# EasyEDA Pro project 赛季装甲板.eprj

# Schematic 装甲板

## Sheets
1 电源: Board Name: Board1; Create Date: 2025-10-13; Page Name: 电源; Project Name: 赛季装甲板; Schematic Name: 装甲板; Update Date: 2025-11-15; Company: 嘉立创EDA; Page Size: A4; Version: V1.0
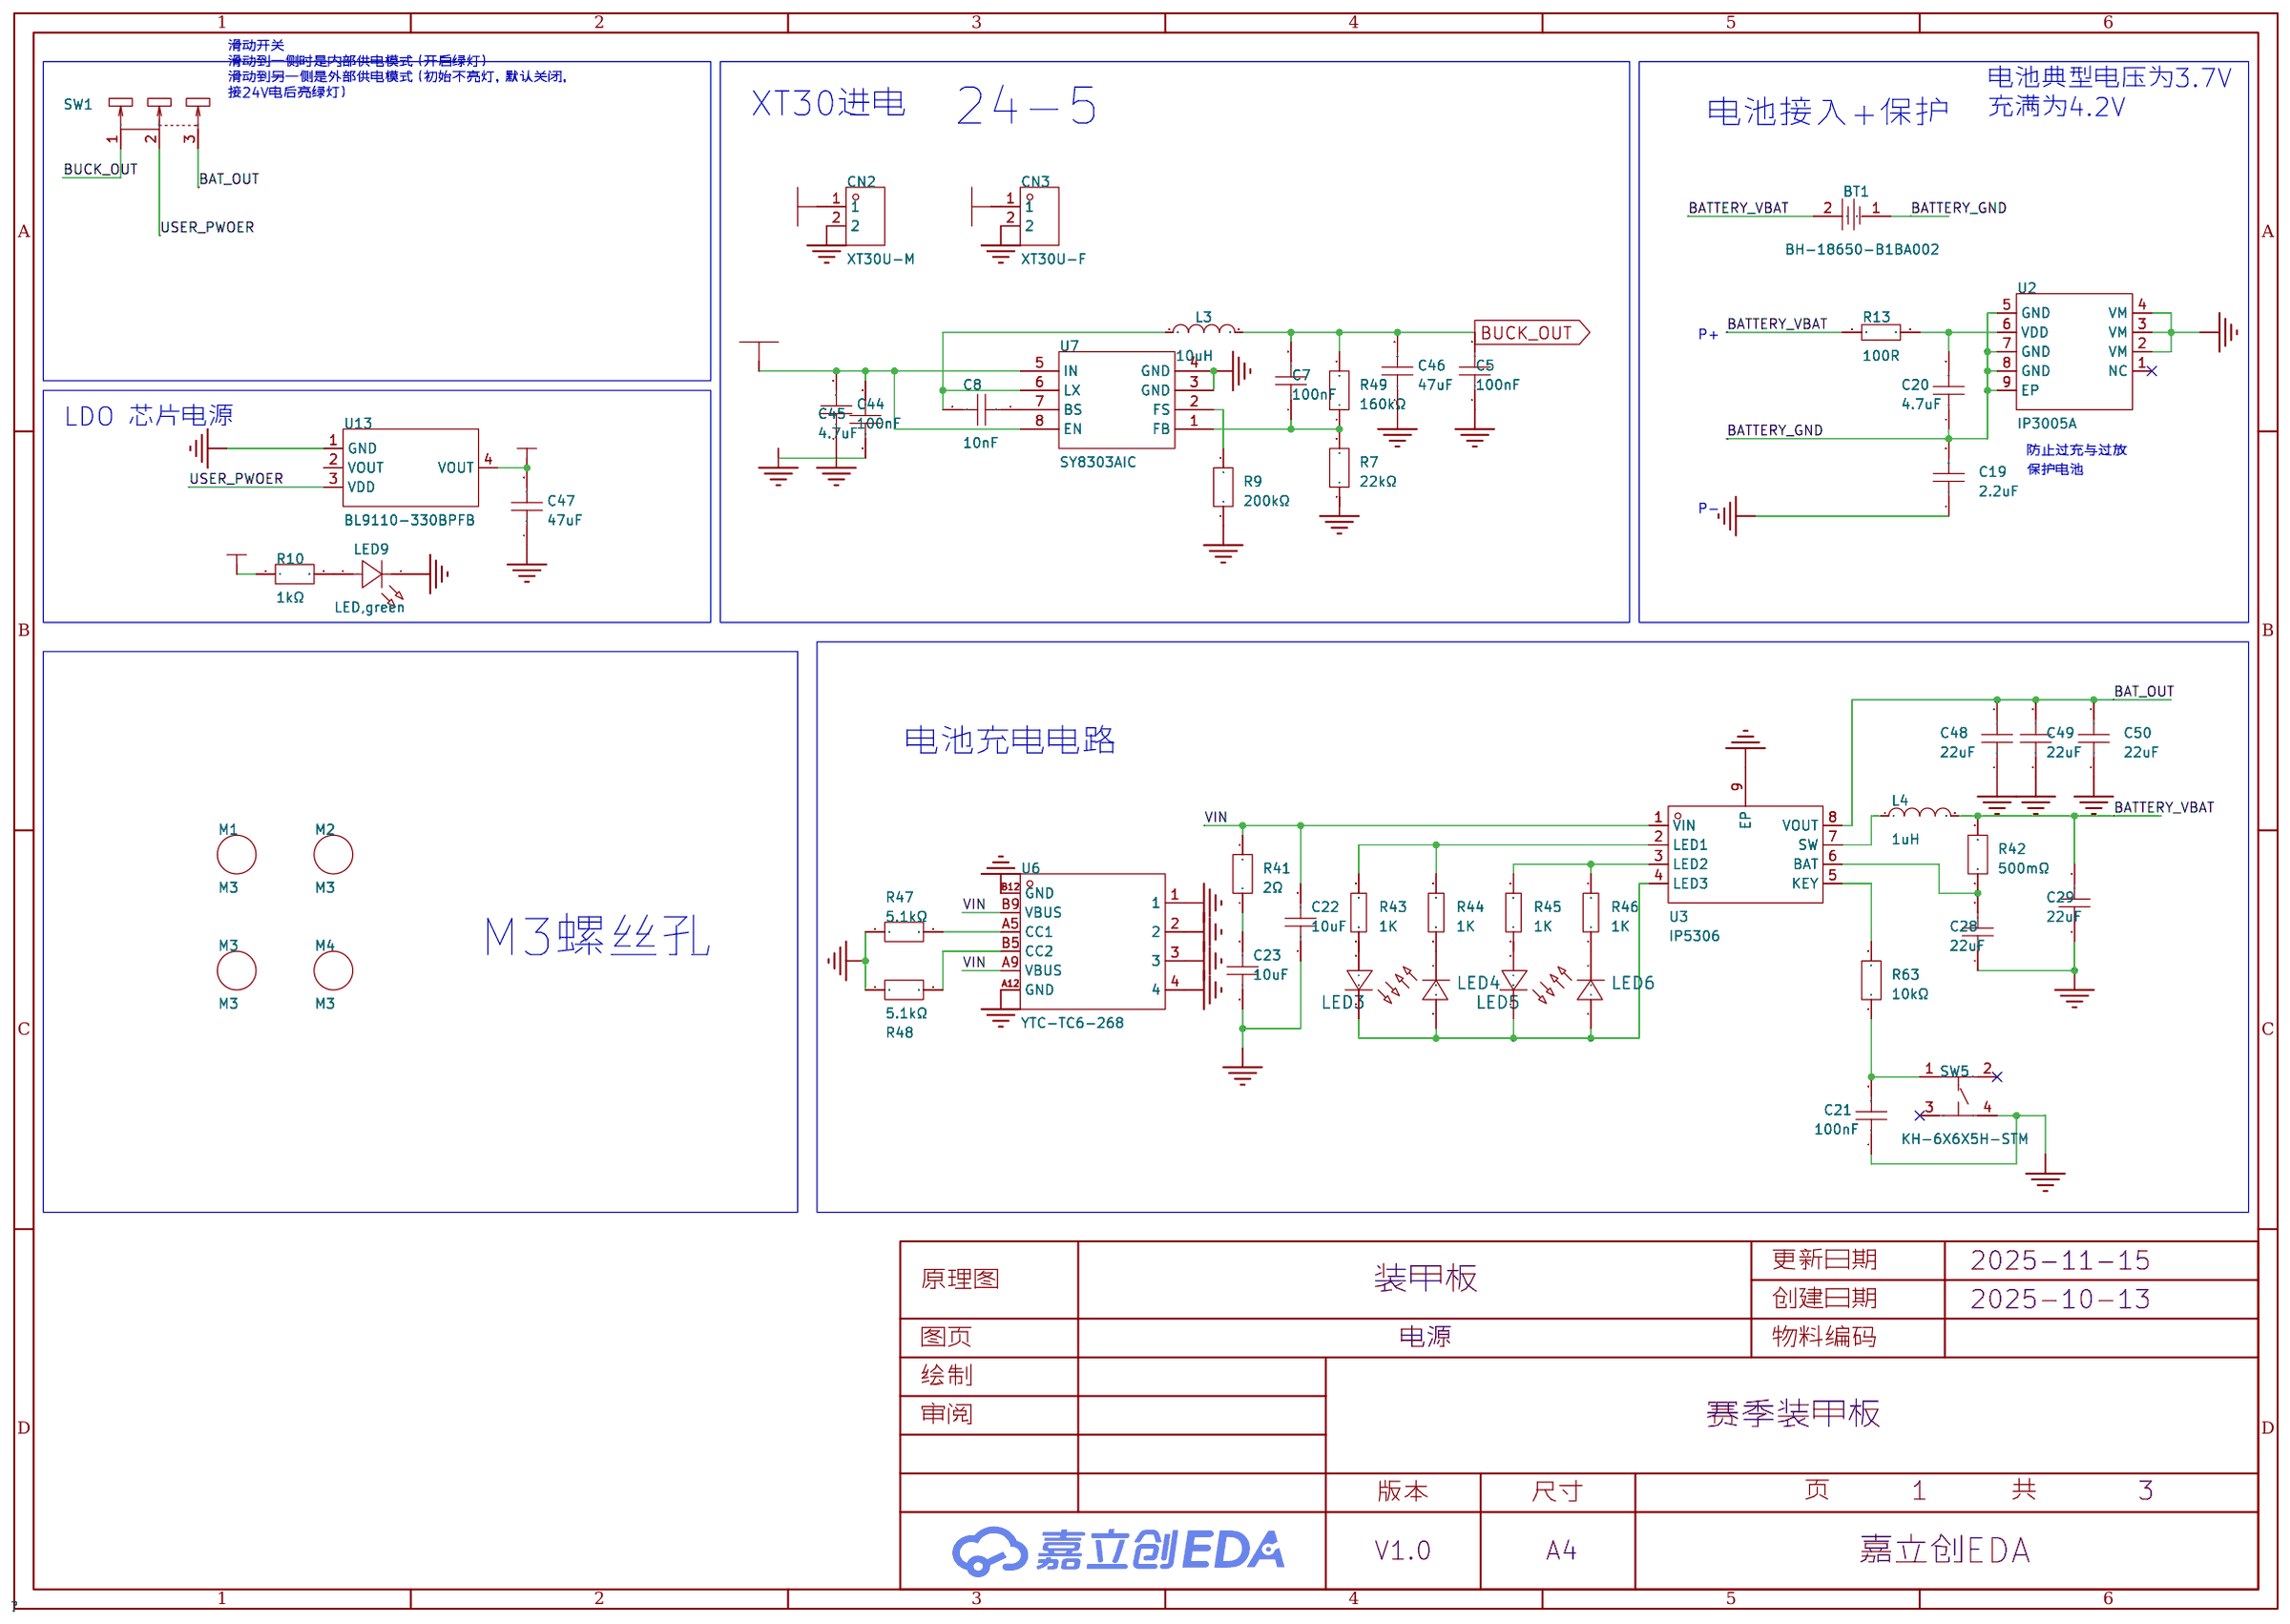
[diagram p0: 电源]
2 主控: Create Date: 2025-10-16; Page Name: 主控; Update Date: 2025-11-14
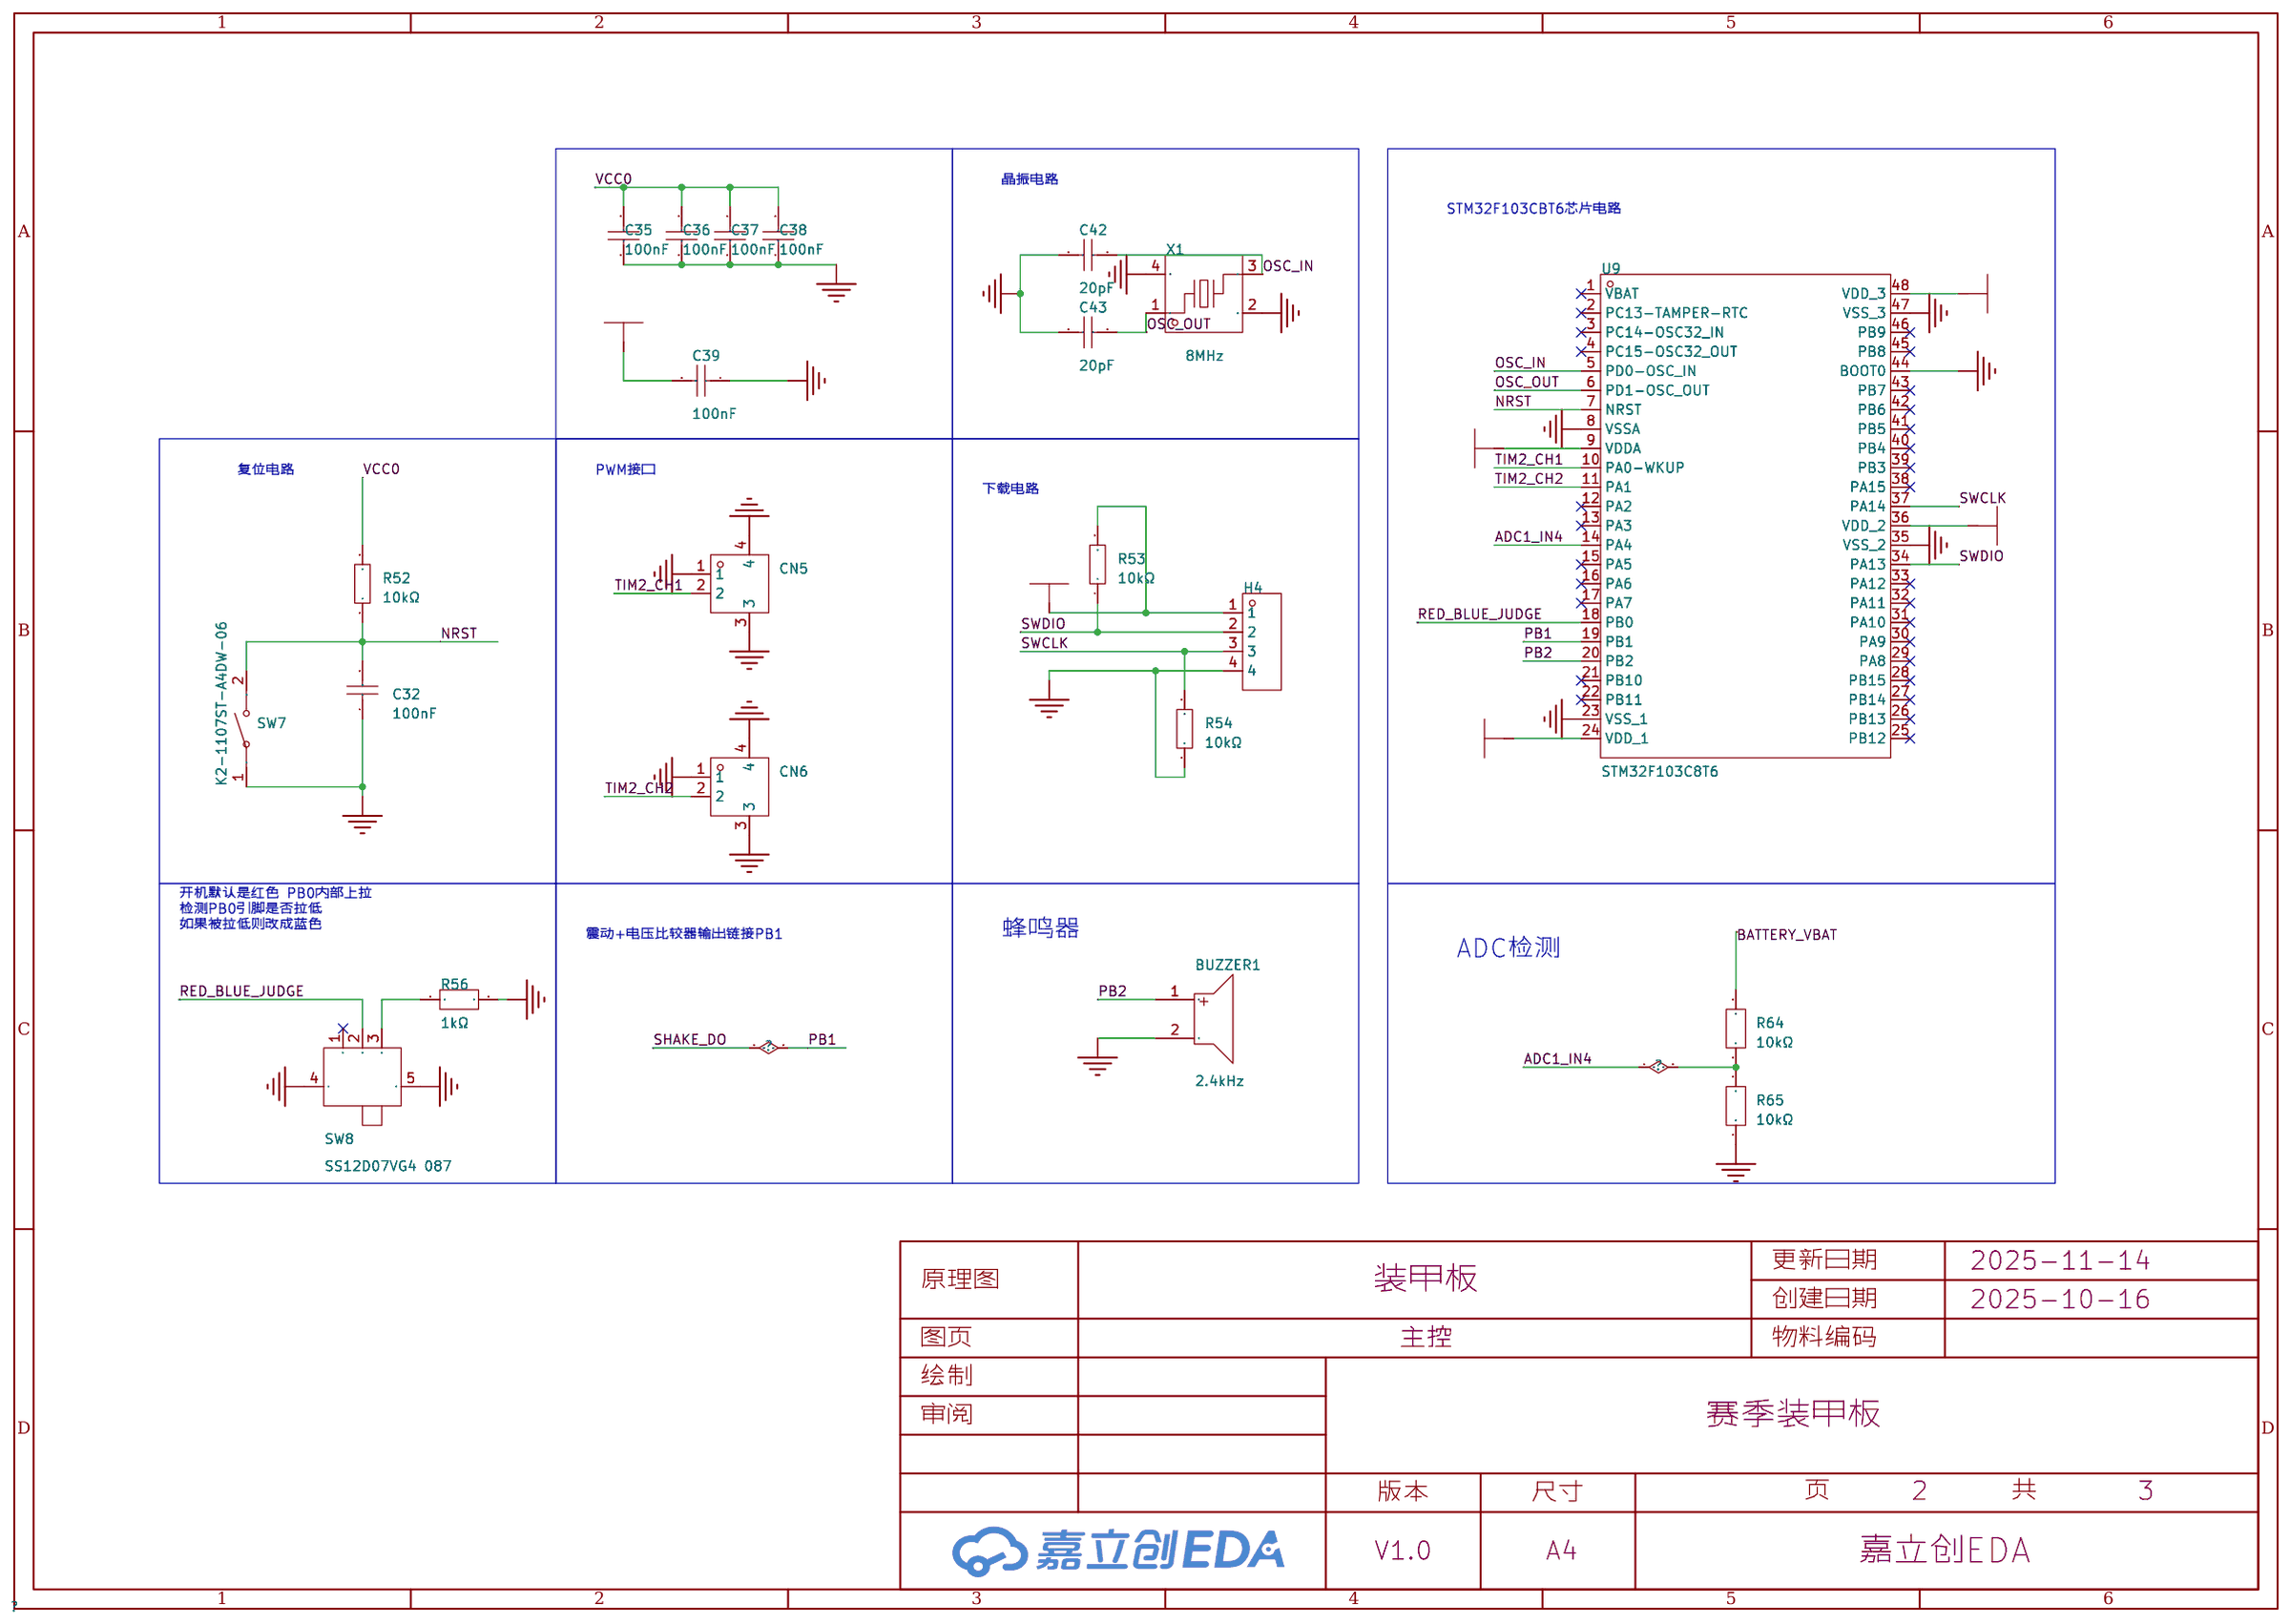
[diagram p1: 主控]
3 震动检测: Create Date: 2025-10-16; Page Name: 震动检测; Project Name: 26赛季装甲板; Update Date: 2025-10-16
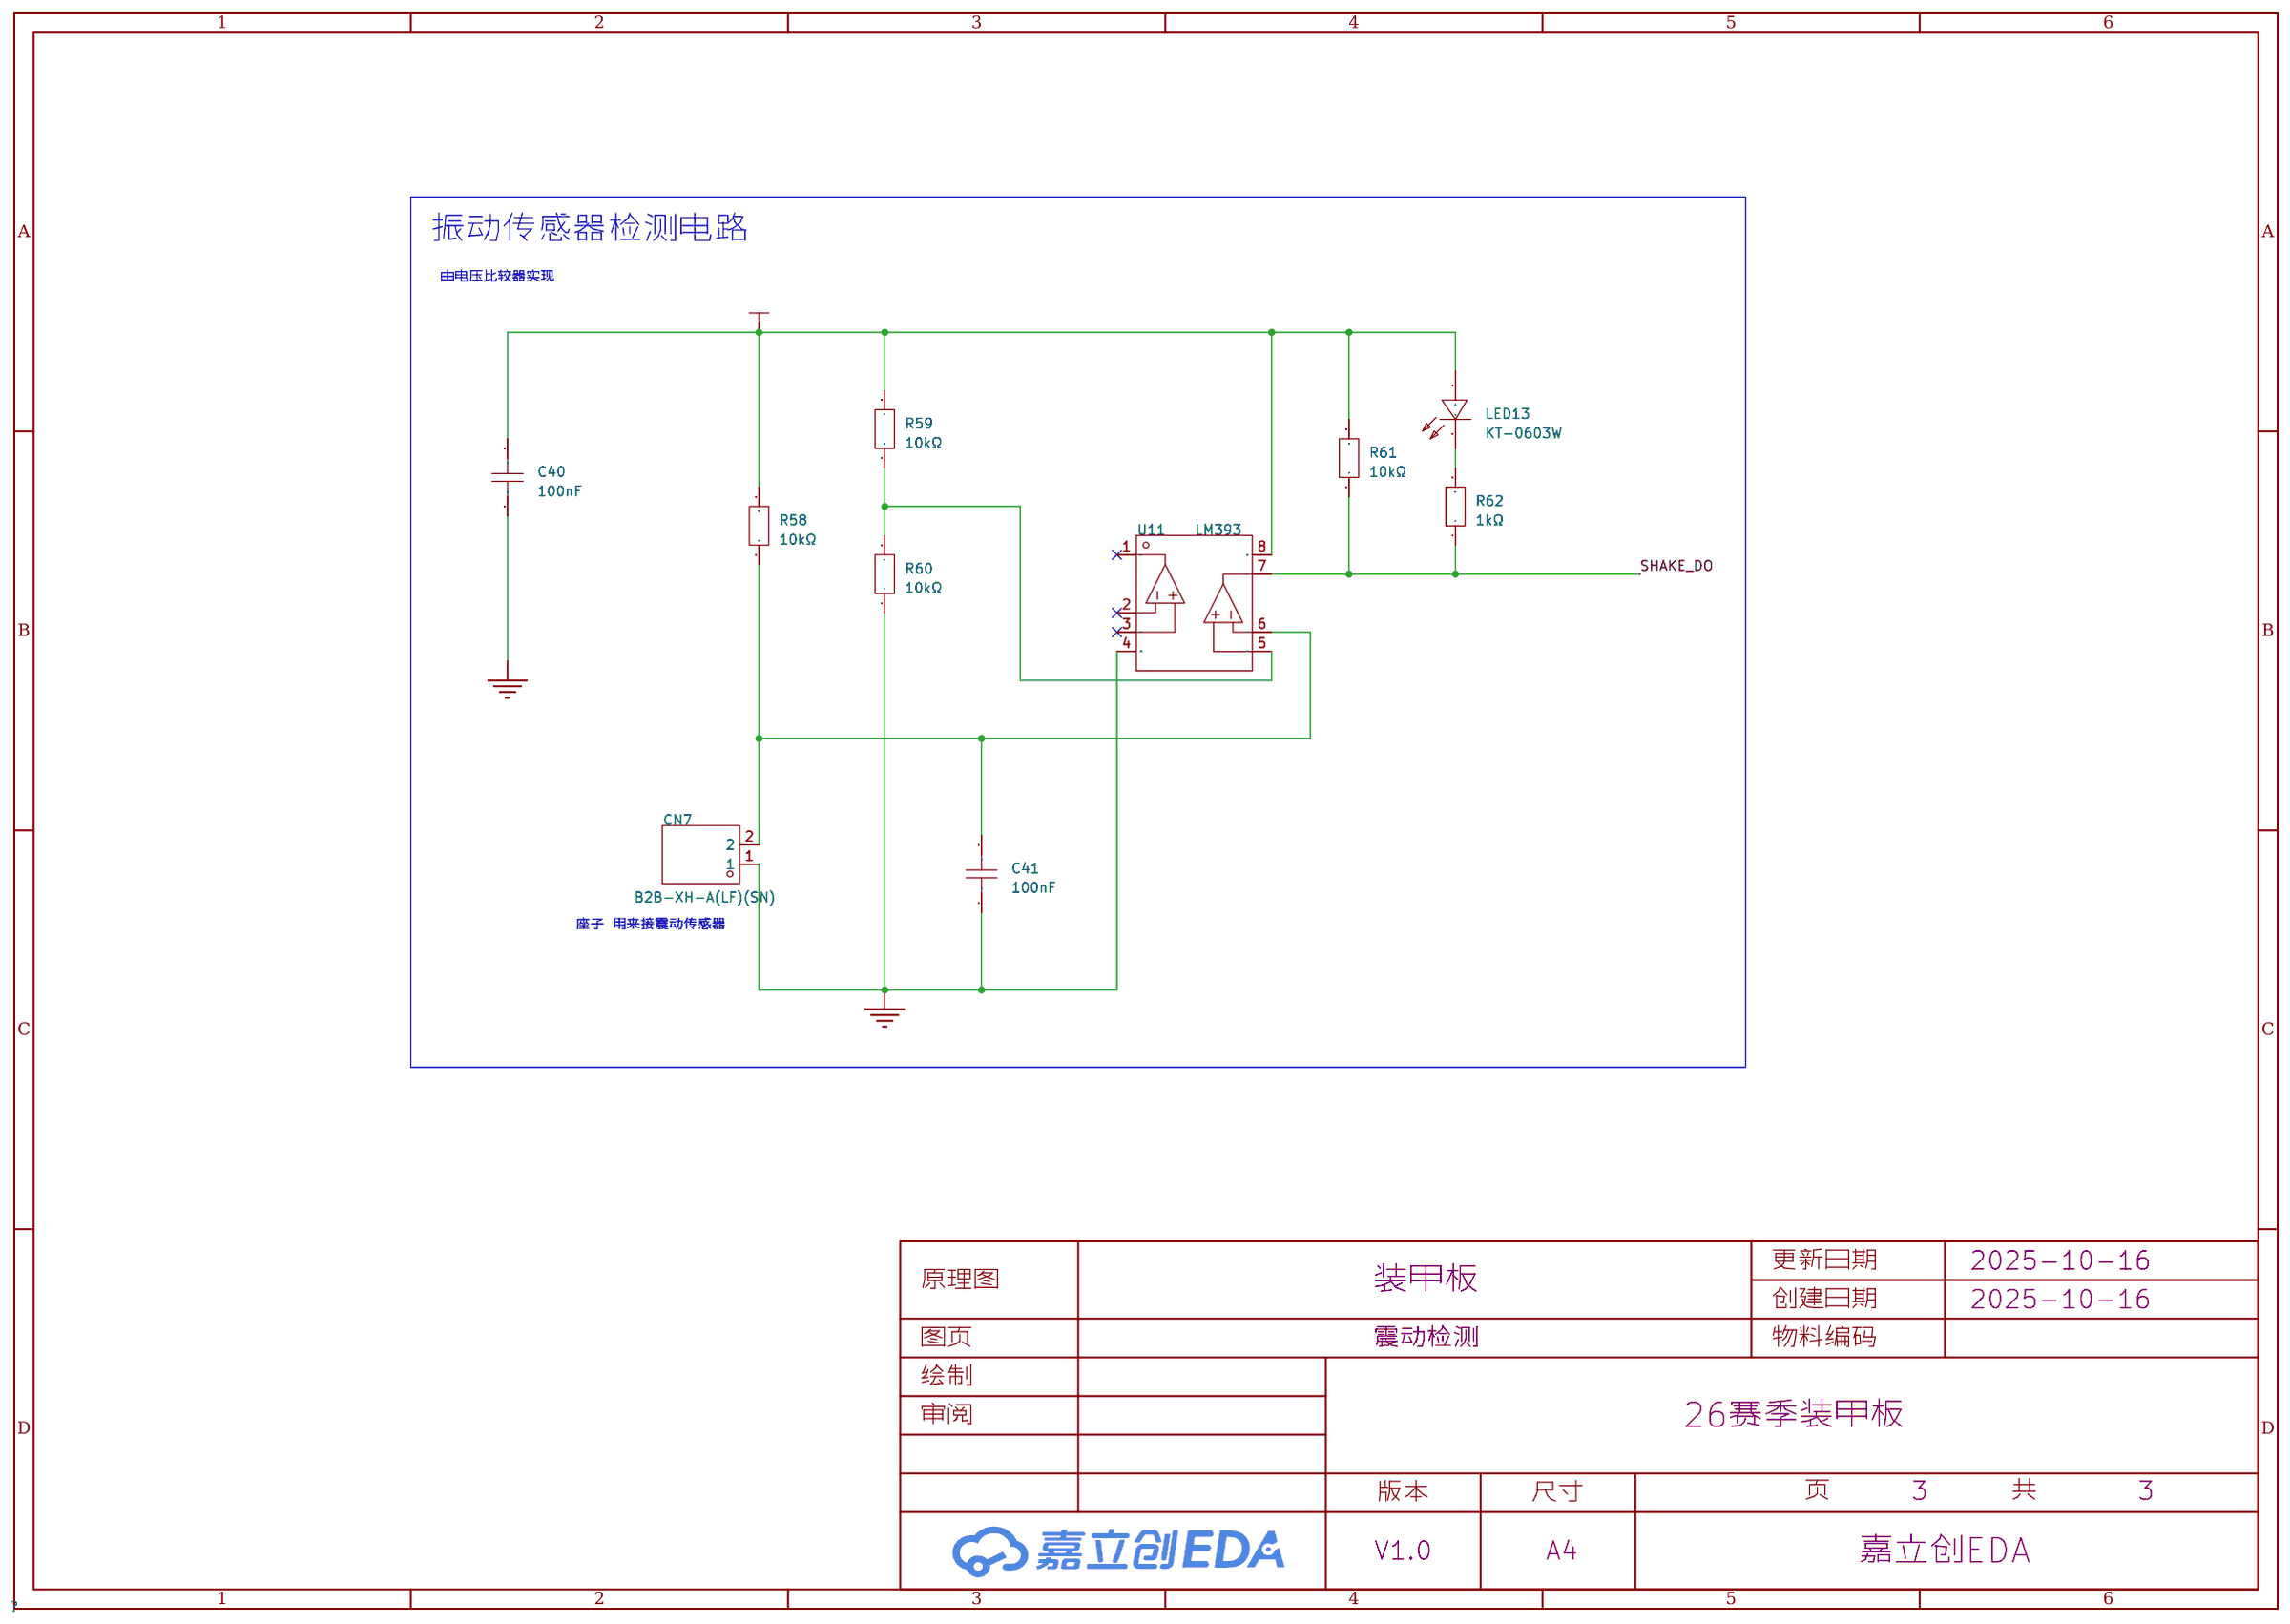
[diagram p2: 震动检测]

## Parts
sheet 主控
BUZZER1  2.4kHz  [BUZ-TH_BD12.0-P7.60-D0.6-FD]
C32  100nF  [C0603]
C35  100nF  [C0603]
C36  100nF  [C0603]
C37  100nF  [C0603]
C38  100nF  [C0603]
C39  100nF  [C0603]
C42  20pF  [C0603]
C43  20pF  [C0603]
CN5  X1251WVS-02HF-LPSW  [郭哥CAN2脚母接口]
CN6  X1251WVS-02HF-LPSW  [郭哥CAN2脚母接口]
H4  -  [HDR-TH_4P-P2.54-V-M]
R52  10kΩ  [R0603]
R53  10kΩ  [R0603]
R54  10kΩ  [R0603]
R56  1kΩ  [R0603]
R64  10kΩ  [R0603]
R65  10kΩ  [R0603]
SW7  K2-1107ST-A4DW-06  [KEY-SMD_L6.2-W3.6-LS8.0]
SW8  SS12D07VG4 087  [SW-TH_SS12D07VG4]
U9  STM32F103C8T6  [LQFP-48_L7.0-W7.0-P0.50-LS9.0-BL]
X1  8MHz  [CRYSTAL-SMD_4P-L3.2-W2.5-BL]
sheet 电源
BT1  BH-18650-B1BA002  [Battery]
C5  100nF  [C0603]
C7  100nF  [C0603]
C8  10nF  [C0603]
C19  2.2uF  [C0603]
C20  4.7uF  [C0603]
C21  100nF  [C0603]
C22  10uF  [C0805]
C23  10uF  [C0805]
C28  22uF  [C0805]
C29  22uF  [C0805]
C44  100nF  [C0805]
C45  4.7uF  [C0805]
C46  47uF  [C0805]
C47  47uF  [C0805]
C48  22uF  [C0603]
C49  22uF  [C0603]
C50  22uF  [C0603]
CN2  XT30U-M  [CONN-TH_XT30U-M]
CN3  XT30U-F  [CONN-TH_XT30U-M]
L3  10uH  [IND-SMD_L7.0-W6.6_FXL0630]
L4  1uH  [IND-SMD_L4.5-W4.1_SL0420]
LED3  -  [LED_0603]
LED4  -  [LED_0603]
LED5  -  [LED_0603]
LED6  -  [LED_0603]
LED9  LED,green  [LED0603-RD_GREEN]
M1  M3  [m3螺丝孔]
M2  M3  [m3螺丝孔]
M3  M3  [m3螺丝孔]
M4  M3  [m3螺丝孔]
R7  22kΩ  [R0603]
R9  200kΩ  [R0603]
R10  1kΩ  [R0603]
R13  100R  [R0603]
R41  2Ω  [R0603]
R42  500mΩ  [R0603]
R43  1K  [R0603]
R44  1K  [R0603]
R45  1K  [R0603]
R46  1K  [R0603]
R47  5.1kΩ  [R0603]
R48  5.1kΩ  [R0603]
R49  160kΩ  [R0603]
R63  10kΩ  [R0603]
SW1  SS-12D10L5  [SW-TH_SS-12D10L5]
SW5  KH-6X6X5H-STM  [SW-SMD_4P-L6.0-W6.0-P4.50-LS9.0_H5.0]
U2  IP3005A  [ESOP-8_L4.9-W3.9-P1.27-LS6.0-BL-EP]
U3  IP5306  [ESOP-8_L4.9-W3.9-P1.27-LS6.0-BL-EP]
U6  YTC-TC6-268  [TYPE-C-SMD_YIYUAN_YTC-TC6-268]
U7  SY8303AIC  [TSOT-23-8_L2.9-W1.6-P0.65-LS2.8-BR]
U13  BL9110-330BPFB  [SOT-223_L6.5-W3.5-P2.30-LS7.0-BR]
sheet 震动检测
C40  100nF  [C0603]
C41  100nF  [C0603]
CN7  B2B-XH-A(LF)(SN)  [CONN-TH_B2B-XH-A-LF-SN]
LED13  KT-0603W  [LED0603-R-RD_WHITE]
R58  10kΩ  [R0603]
R59  10kΩ  [R0603]
R60  10kΩ  [R0603]
R61  10kΩ  [R0603]
R62  1kΩ  [R0603]
U11  LM393  [SOP-8_L4.9-W3.9-P1.27-LS6.0-BL]

## Library data of the parts
BUZZER1 = TMB12A05_C49246931: LCSC Part Name: 蜂鸣器; Supplier Part: C49246931; Manufacturer: XHXDZ(兴华鑫); Manufacturer Part: TMB12A05; Supplier Footprint: 插件,D12xL9.5mm; JLCPCB Part Class: 扩展库; Datasheet: https://item.szlcsc.com/datasheet/TMB12A05/51674900.html; Supplier: LCSC; Driver Circuitry: 有源(内含驱动线路); Technology: 电磁式; Voltage Rating: 5V; Voltage - Supply: 3V~7V; Diameter(φD): 12mm; Height: 9.5mm
C32 C35-C39 = CL10F104ZB8NNNC: 容值:100nF;精度:-20%~+80%;额定电压:50V;材质(温度系数):Y5V;; LCSC Part Name: 100nF -20%~+80% 50V; Supplier Part: C1688; Manufacturer: SAMSUNG(三星); Supplier Footprint: 0603; JLCPCB Part Class: Extended Part; Datasheet: https://atta.szlcsc.com/upload/public/pdf/source/20160103/1457707690730.pdf; Supplier: LCSC; Tolerance: -20%~+80%; Voltage Rated: 50V; Temperature Coefficient: Y5V
C42 C43 = CL10C200JB8NNNC: LCSC Part Name: 20pF ±5% 50V; Supplier Part: C1648; Manufacturer: SAMSUNG(三星); Supplier Footprint: 0603; JLCPCB Part Class: 基础库; Datasheet: https://item.szlcsc.com/datasheet/CL10C200JB8NNNC/2000.html; Supplier: LCSC; Tolerance: ±5%; Voltage Rating: 50V; Temperature Coefficient: C0G
CN5 CN6 = X1251WVS-02HF-LPSW: Supplier: LCSC; Supplier Part: C388714; Manufacturer: XKB Enterprise
H4 = HDR-M_2.54_1x4P: Supplier Part: C492403; Supplier Footprint: 插件
R52-R54 = AR03BTDX1002: 温度系数:±50ppm/℃;阻值:10kΩ;精度:±0.1%;功率:100mW;工作温度范围:-55℃~+155℃;电阻类型:薄膜电阻;最大工作电压:50V;; LCSC Part Name: 10kΩ ±0.1%; Supplier Part: C319938; Manufacturer: Viking(光颉); Supplier Footprint: 0603; JLCPCB Part Class: Extended Part; Datasheet: https://atta.szlcsc.com/upload/public/pdf/source/20181130/C319938_77E38B8D4CD7481495A6FE69BA8AB438.pdf; Supplier: LCSC; Temperature Coefficient: ±50ppm/℃; Tolerance: ±0.1%; Power(Watts): 100mW; Operating Temperature Range: -55℃~+155℃; Type: 薄膜电阻; Overload Voltage (Max): 50V
R56 = FRR0603J102 TS: LCSC Part Name: 厚膜电阻 0603 1KΩ ±5% 100mW; Supplier Part: C49196793; Manufacturer: FOJAN(富捷); Supplier Footprint: 0603; JLCPCB Part Class: 扩展库; Datasheet: https://item.szlcsc.com/datasheet/FRR0603J102%2520TS/51599041.html; Supplier: LCSC; Type: 厚膜电阻; Tolerance: ±5%; Power(Watts): 100mW; Voltage-Supply(Max): 75V; Temperature Coefficient: ±100ppm/℃; Operating Temperature: -55℃~+155℃
R64 R65 = RCA060310K0FKEAHP: LCSC Part Name: 厚膜电阻 10kΩ ±1% 250mW; Supplier Part: C2074209; Manufacturer: VISHAY(威世); Supplier Footprint: 0603; JLCPCB Part Class: 扩展库; Datasheet: https://item.szlcsc.com/datasheet/RCA060310K0FKEAHP/2165795.html; Supplier: LCSC; Type: 厚膜电阻; Tolerance: ±1%; Power(Watts): 250mW; Voltage-Supply(Max): 75V; Temperature Coefficient: ±100ppm/℃; Operating Temperature: -55℃~+155℃
SW7 = K2-1107ST-A4DW-06: 电路结构:单刀单掷;按钮形状:矩形按钮;作用力:250gf;安装方式:立贴;开关长度:6.1mm;开关宽度:3.6mm;开关高度:2.5mm;触点电流:50mA;额定电压(DC):12V;绝缘电阻:100MΩ;带灯:-;机械寿命:10万次;; LCSC Part Name: 轻触开关 3.6*6.1*2.5; Supplier Part: C118141; Manufacturer: 韩国韩荣; Supplier Footprint: SMD; JLCPCB Part Class: 扩展库; Datasheet: https://atta.szlcsc.com/upload/public/pdf/source/20210810/381712CEF248770C072B585C3485C888.pdf; Supplier: LCSC; Circuit: 单刀单掷; Actuator Style: 矩形按钮; Operating Force: 250gf; Mounting Style: 立贴; Switch Length: 6.1mm; Switch Width: 3.6mm; Switch Height: 2.5mm; Contact Current: 50mA; Voltage Rating (DC): 12V; Insulation Resistance: 100MΩ; Mechanical Life: 10万次; Operating Temperature: -25℃~+85℃
SW8 = SS12D07VG4 087: Supplier Part: C2939726; Manufacturer: SHOU HAN(首韩); Supplier Footprint: 插件,8.7x4.4mm; JLCPCB Part Class: 扩展库; Datasheet: https://item.szlcsc.com/datasheet/SS12D07VG4%2520087/3301205.html; Supplier: LCSC; Circuit: 单刀双掷; Termination Style: PC引脚; Length: 8.7mm; Width: 4.4mm; Switch Height: 4.7mm; Mounting Type: 直插; Current Rating: 500mA; Voltage Rating: 50V; Life: 5千次; Operating Temperature: -10℃~+50℃
U9 = STM32F103C8T6: CPU内核:ARM Cortex-M3;CPU最大主频:72MHz;工作电压范围:2V~3.6V;内部振荡器:有;程序 FLASH容量:64K@x8bit;RAM总容量:20KB;EEPROM/数据 FLASH容量:-;GPIO端口数量:37;ADC(单元数/通道数/位数):1@x10ch/12bit;外设/功能/协议栈:温度传感器；DMA；看门狗；POR；PWM;工作温度范围:-40℃~+85℃;; LCSC Part Name: ARM Cortex-M3 72MHz 64K@x8bit 20KB MSL=3; Supplier Part: C8734; Manufacturer: ST(意法半导体); Supplier Footprint: LQFP-48_7x7x05P; JLCPCB Part Class: Basic Part; Datasheet: https://atta.szlcsc.com/upload/public/pdf/source/20140724/1457707174202.pdf; Supplier: LCSC; CPU Core: ARM Cortex-M3; Maximum Frequency: 72MHz; Supply Voltage Range: 2V~3.6V; Internal Oscillator: 有; Program FLASH Size: 64K@x8bit; RAM Size: 20KB; GPIO Ports Number: 37; ADC (Units/Channels/bits): 1@x10ch/12bit; Peripherals / Functions / Protocol Stacks: 温度传感器；DMA；看门狗；POR；PWM; Operating Temperature Range: -40℃~+85℃
X1 = X32258MSB4SI: LCSC Part Name: YSX321SL 8MHZ 4P 3225 20PF ±10PPM -40~85℃ (±20PPM); Supplier Part: C2682774; Manufacturer: YXC(扬兴晶振); Supplier Footprint: SMD3225-4P; JLCPCB Part Class: 扩展库; Datasheet: https://item.szlcsc.com/datasheet/X32258MSB4SI/2777871.html; Supplier: LCSC; Type: 贴片晶振; Normal temperature Frequency Tolerance: ±10ppm; Load Capacitance: 20pF; Frequency Stability: ±20ppm; Equivalent Series Resistance(ESR): 120Ω; Operating Temperature: -40℃~+85℃
BT1 = BH-18650-B1BA002: LCSC Part Name: 电池盒 适用电池:18650; Supplier Part: C2988620; Manufacturer: MYOUNG(美阳); Supplier Footprint: SMD; JLCPCB Part Class: 扩展库; Datasheet: https://item.szlcsc.com/datasheet/BH-18650-B1BA002/3446919.html; Supplier: LCSC; Connector Type: 电池盒; Battery Type: 18650
C5 C7 C21 = 06031C104K4T2A: 容值:100nF;精度:±10%;额定电压:100V;温度系数:X7R;; LCSC Part Name: 100nF ±10% 100V; Supplier Part: C1880996; Manufacturer: Kyocera AVX; Supplier Footprint: 0603; JLCPCB Part Class: 扩展库; Supplier: LCSC; Tolerance: ±10%; Voltage Rating: 100V; Temperature Coefficient: X7R
C8 = VJ0603Y103KXBAC: 容值:10nF;精度:±10%;额定电压:100V;温度系数:X7R;; LCSC Part Name: 10nF ±10% 100V; Supplier Part: C2185316; Manufacturer: VISHAY(威世); Supplier Footprint: 0603; JLCPCB Part Class: 扩展库; Datasheet: https://atta.szlcsc.com/upload/public/pdf/source/20210605/81C3F60E11E5CF11F268FCED998F9AB0.pdf; Supplier: LCSC; Tolerance: ±10%; Voltage Rating: 100V; Temperature Coefficient: X7R
C19 = 0603X225M100NT: 容值:2.2uF;精度:±20%;额定电压:10V;温度系数:X5R;; LCSC Part Name: 2.2uF ±20% 10V; Supplier Part: C2857986; Manufacturer: FH(风华); Supplier Footprint: 0603; JLCPCB Part Class: 扩展库; Datasheet: https://atta.szlcsc.com/upload/public/pdf/source/20241106/0372DBB53BE7B2875A5094F78173A7D7.pdf; Supplier: LCSC; Tolerance: ±20%; Voltage Rating: 10V; Temperature Coefficient: X5R
C20 = GRT188C81E475KE13D: 容值:4.7uF;精度:±10%;额定电压:25V;温度系数:X6S;; LCSC Part Name: 4.7uF ±10% 25V; Supplier Part: C907917; Manufacturer: muRata(村田); Supplier Footprint: 0603; JLCPCB Part Class: 扩展库; Datasheet: https://atta.szlcsc.com/upload/public/pdf/source/20201022/C907724_54A5B6BD9983EF10856A9875562800AA.pdf; Supplier: LCSC; Tolerance: ±10%; Voltage Rating: 25V; Temperature Coefficient: X6S
C22 C23 = TCC0805X5R106M160FTN: 容值:10uF;精度:±20%;额定电压:16V;温度系数:X5R;; LCSC Part Name: 10uF ±20% 16V; Supplier Part: C18185773; Manufacturer: CCTC(三环); Supplier Footprint: 0805; JLCPCB Part Class: 扩展库; Datasheet: https://atta.szlcsc.com/upload/public/pdf/source/20191203/C466239_F62A586702D44EEA1C39B32FC8662B21.pdf; Supplier: LCSC; Tolerance: ±20%; Voltage Rating: 16V; Temperature Coefficient: X5R
C28 C29 = CL21Z226MQYVPNE: 容值:22uF;精度:±20%;额定电压:6.3V;温度系数:X7T;; LCSC Part Name: 22uF ±20% 6.3V; Supplier Part: C6150103; Manufacturer: SAMSUNG(三星); Supplier Footprint: 0805; JLCPCB Part Class: 扩展库; Datasheet: https://atta.szlcsc.com/upload/public/pdf/source/20241202/1BDE01DAB2E9CA02F4EFA28F0C1F172B.pdf; Supplier: LCSC; Tolerance: ±20%; Voltage Rating: 6.3V; Temperature Coefficient: X7T
C44 = CC0805KRX7R9BB104: LCSC Part Name: 100nF ±10% 50V; Supplier Part: C49678; Manufacturer: YAGEO(国巨); Supplier Footprint: 0805; JLCPCB Part Class: 基础库; Datasheet: https://item.szlcsc.com/datasheet/CC0805KRX7R9BB104/50686.html; Supplier: LCSC; Tolerance: ±10%; Voltage Rating: 50V; Temperature Coefficient: X7R
C45 = GRM21BZ71H475KE15L: LCSC Part Name: 4.7uF ±10% 50V; Supplier Part: C437557; Manufacturer: muRata(村田); Supplier Footprint: 0805; JLCPCB Part Class: 扩展库; Datasheet: https://item.szlcsc.com/datasheet/GRM21BZ71H475KE15L/436012.html; Supplier: LCSC; Tolerance: ±10%; Voltage Rating: 50V; Temperature Coefficient: X7R
C46 C47 = CGA0805X5R476M100MT: LCSC Part Name: 47uF ±20% 10V; Supplier Part: C6119904; Manufacturer: HRE(芯声); Supplier Footprint: 0805; JLCPCB Part Class: 扩展库; Supplier: LCSC; Tolerance: ±20%; Voltage Rating: 10V; Temperature Coefficient: X5R
C48-C50 = GRM188R60J226MEA0D: LCSC Part Name: 22uF 6.3V; Supplier Part: C77042; Manufacturer: muRata(村田); Supplier Footprint: 0603; JLCPCB Part Class: Extended Part; Datasheet: https://atta.szlcsc.com/upload/public/pdf/source/20180326/C77042_18993FD44476F8FF9D8A5462A6DC302B.pdf; Supplier: LCSC; Tolerance: ±20%; Voltage Rated: 6.3V; Temperature Coefficient: X5R
CN2 = XT30U-M: LCSC Part Name: AMASS(艾迈斯)轻量版锂电池插头公头 XT30U-M; Supplier Part: C99101; Manufacturer: AMASS(艾迈斯); JLCPCB Part Class: Extended Part; Datasheet: https://item.szlcsc.com/datasheet/XT30U-M/100314.html; Supplier: LCSC; Type: 插头; Colour: 黄色; InterfaceType: 公头
CN3 = XT30U-M: LCSC Part Name: AMASS(艾迈斯)轻量版锂电池插头公头 XT30U-M; Supplier Part: C99102; Manufacturer: AMASS(艾迈斯); JLCPCB Part Class: Extended Part; Datasheet: https://item.szlcsc.com/datasheet/XT30U-M/100314.html; Supplier: LCSC; Type: 插头; Colour: 黄色; InterfaceType: 公头
L3 = FXL0630-470-M: 电感值:47uH;精度:±20%;额定电流:1.5A;饱和电流(Isat):2A;类型:一体成型电感;; LCSC Part Name: 47uH ±20% 2A; Supplier Part: C475913; Manufacturer: cjiang(长江微电); Supplier Footprint: SMD,6.6x7mm; JLCPCB Part Class: 扩展库; Datasheet: https://atta.szlcsc.com/upload/public/pdf/source/20240426/3189EA8206330E2108542F9E34E540E7.pdf; Supplier: LCSC; Tolerance: ±20%; Rated Current: 1.5A; Saturation Current (Isat): 2A; DC Resistance (DCR): 385mΩ; Type: 一体成型电感
L4 = SL0420-1R0M: LCSC Part Name: 1uH ±20% 7A; Supplier Part: C22463805; Manufacturer: 台湾陆海; Supplier Footprint: SMD,4.5x4.1mm; JLCPCB Part Class: 扩展库; Datasheet: https://atta.szlcsc.com/upload/public/pdf/source/20240611/8DE7D6BE1273F2E871C82A6D5C20B08D.pdf; Supplier: LCSC; Tolerance: ±20%; Rated Current: 6A; Saturation Current (Isat): 7A
LED3-LED6 = LED_0603-R: Supplier Footprint: 0603
LED9 = LED,green: Supplier Part: C9900023196; Supplier Footprint: LED-0603; JLCPCB Part Class: 扩展库; Supplier: LCSC
M1-M4 = M3: 铜柱孔; BOM名称: 铜柱孔; 学习资源: www.ooocke.com; 版权归属: 源创客; Origin Footprint 2: M3 140X350; Origin Footprint 3: M3 125X300; Origin Footprint 1: M3 125X200; Library Name: Schlib1
R7 = RN73H1JTTD2202C10: 电阻类型:金属膜电阻;阻值:22kΩ;精度:±0.25%;功率:100mW;温度系数:±10ppm/℃;; LCSC Part Name: 22kΩ ±0.25% 100mW; Supplier Part: C4071566; Manufacturer: KOA; Supplier Footprint: 0603; JLCPCB Part Class: 扩展库; Datasheet: https://atta.szlcsc.com/upload/public/pdf/source/20240329/18AD19F217F5EF2CC9094BC398D632CF.pdf; Supplier: LCSC; Type: 金属膜电阻; Tolerance: ±0.25%; Power(Watts): 100mW; Temperature Coefficient: ±10ppm/℃
R9 = MCT06030C2000FP500: 电阻类型:薄膜电阻;阻值:200Ω;精度:±1%;功率:125mW;工作电压:75V;温度系数:±50ppm/℃;; LCSC Part Name: 薄膜电阻 200Ω ±1% 125mW; Supplier Part: C2074187; Manufacturer: VISHAY(威世); Supplier Footprint: 0603; JLCPCB Part Class: 扩展库; Datasheet: https://atta.szlcsc.com/upload/public/pdf/source/20210602/C08CCF195AE51CC22ABA3E19A22B2896.pdf; Supplier: LCSC; Type: 薄膜电阻; Tolerance: ±1%; Power(Watts): 125mW; Voltage-Supply(Max): 75V; Temperature Coefficient: ±50ppm/℃; Operating Temperature: -55℃~+155℃
R10 = RS73F1JTTD1001B: 电阻类型:厚膜电阻;阻值:1kΩ;精度:±0.1%;功率:200mW;工作电压:-;温度系数:±25ppm/℃;; LCSC Part Name: 厚膜电阻 1kΩ ±0.1% 200mW; Supplier Part: C2595445; Manufacturer: KOA; Supplier Footprint: 0603; JLCPCB Part Class: 扩展库; Datasheet: https://atta.szlcsc.com/upload/public/pdf/source/20211129/A535FF221EB627E9DCB5BEEA785E69F9.pdf; Supplier: LCSC; Type: 厚膜电阻; Tolerance: ±0.1%; Power(Watts): 200mW; Temperature Coefficient: ±25ppm/℃; Operating Temperature: -55℃~+155℃
R13 R43-R46 = Res_0603: Supplier Footprint: 0603
R41 = SDR03EZPJ2R0: 电阻类型:厚膜电阻;阻值:2Ω;精度:±5%;功率:300mW;温度系数:±200ppm/℃;; LCSC Part Name: 厚膜电阻 2Ω ±5% 300mW; Supplier Part: C6473088; Manufacturer: ROHM(罗姆); Supplier Footprint: 0603; JLCPCB Part Class: 扩展库; Datasheet: https://atta.szlcsc.com/upload/public/pdf/source/20210610/6AB92565165FC301CC64334D0D03704B.pdf; Supplier: LCSC; Type: 厚膜电阻; Tolerance: ±5%; Power(Watts): 300mW; Temperature Coefficient: ±200ppm/℃; Operating Temperature: -55℃~+155℃
R42 = SCR0603JR500: 电阻类型:厚膜电阻;阻值:500mΩ;精度:±5%;功率:100mW;工作电压:75V;; LCSC Part Name: 厚膜电阻 500mΩ ±5% 100mW; Supplier Part: C3017643; Manufacturer: VO(翔胜); Supplier Footprint: 0603; JLCPCB Part Class: 扩展库; Datasheet: https://atta.szlcsc.com/upload/public/pdf/source/20220513/247AF9639BA21CF93567DC289CCC6A22.pdf; Supplier: LCSC; Type: 厚膜电阻; Tolerance: ±5%; Power(Watts): 100mW; Voltage-Supply(Max): 75V; Operating Temperature: -55℃~+155℃
R47 R48 = TNPW06035K10BEEA: LCSC Part Name: 薄膜电阻 5.1kΩ ±0.1% 100mW; Supplier Part: C2088892; Manufacturer: VISHAY(威世); Supplier Footprint: 0603; JLCPCB Part Class: 扩展库; Datasheet: https://item.szlcsc.com/datasheet/TNPW06035K10BEEA/2180483.html; Supplier: LCSC; Type: 薄膜电阻; Tolerance: ±0.1%; Power(Watts): 100mW; Voltage-Supply(Max): 75V; Temperature Coefficient: ±25ppm/℃; Operating Temperature: -55℃~+155℃
R49 = FRC0603F1603TS: LCSC Part Name: 160kΩ ±1% 100mW 厚膜电阻; Supplier Part: C2930068; Manufacturer: FOJAN(富捷); Supplier Footprint: 0603; JLCPCB Part Class: 扩展库; Supplier: LCSC; Type: 厚膜电阻; Tolerance: ±1%; Power(Watts): 100mW; Voltage-Supply(Max): 75V; Temperature Coefficient: ±100ppm/℃; Operating Temperature: -55℃~+155℃
R63 = FRC0603J103 TS: LCSC Part Name: 10kΩ ±5% 100mW 厚膜电阻; Supplier Part: C2930027; Manufacturer: FOJAN(富捷); Supplier Footprint: 0603; JLCPCB Part Class: 扩展库; Datasheet: https://item.szlcsc.com/datasheet/FRC0603J103%2520TS/3266960.html; Supplier: LCSC; Type: 厚膜电阻; Tolerance: ±5%; Power(Watts): 100mW; Voltage-Supply(Max): 75V; Temperature Coefficient: ±100ppm/℃; Operating Temperature: -55℃~+155℃
SW1 = SS-12D10L5: LCSC Part Name: 柄长5mm 直插双档 滑动开关; Supplier Part: C319012; Manufacturer: XKB Connection(中国星坤); Supplier Footprint: 插件,13x6.8mm; JLCPCB Part Class: 扩展库; Datasheet: https://item.szlcsc.com/datasheet/SS-12D10L5/300104.html; Supplier: LCSC; Circuit: 单刀双掷; Actuator Style: 矩形柱状; Termination Style: PC引脚; Length: 13mm; Width: 6.8mm; Switch Height: 6.4mm; Mounting Type: 直插; Actuator Color: 黑色; Current Rating: 3A; Voltage Rating: 125V; Life: 1万次; Operating Temperature: -40℃~+85℃
SW5 = KH-6X6X5H-STM: 电路结构:单刀单掷;按钮形状:圆形按钮;安装方式:立贴;开关长度:6mm;开关宽度:6mm;开关高度:5mm;带支架:不带;触点电流:50mA;额定电压(DC):12V;机械寿命:8万次;; LCSC Part Name: 6*6*5mm 立贴 轻触开关; Supplier Part: C2837531; Manufacturer: kinghelm(金航标); Supplier Footprint: SMD; JLCPCB Part Class: 扩展库; Datasheet: https://atta.szlcsc.com/upload/public/pdf/source/20210608/C2837531_45E87AB996CE723B09405FF2EA209C4C.pdf; Supplier: LCSC; Circuit: 单刀单掷; Actuator Style: 圆形按钮; Mounting Style: 立贴; Switch Length: 6mm; Switch Width: 6mm; Switch Height: 5mm; Strike Gundam: 不带; Contact Current: 50mA; Voltage Rating (DC): 12V; Actuator/Cap Color: 黑色; Pin Style: 鸥翼型; Mechanical Life: 8万次
U2 = IP3005A: 过充电压:4.28V,过充恢复电压:4.1V,高精度内置MOSFET单节锂电池保护IC; Supplier Part: C181685; Manufacturer: INJOINIC(英集芯); Supplier Footprint: ESOP-8; JLCPCB Part Class: 扩展库; Datasheet: https://atta.szlcsc.com/upload/public/pdf/source/20181019/C181685_8FCD62B90ABBC24A3EFF28CA6DF89AAB.pdf; Supplier: LCSC
U3 = IP5306: 2.1A充电2.4A放电高集成度移动电源SOC; Supplier Part: C181692; Manufacturer: INJOINIC(英集芯); Supplier Footprint: ESOP-8; JLCPCB Part Class: 扩展库; Datasheet: https://atta.szlcsc.com/upload/public/pdf/source/20190627/C384572_9925B3DDC4041BC6108E5AB46A2A0AB1.pdf; Supplier: LCSC
U6 = YTC-TC6-268: 连接器类型:Type-C;公母:母;触点数量:6P;; LCSC Part Name: Type-C 母; Supplier Part: C5260484; Manufacturer: YIYUAN(怡远); Supplier Footprint: SMD; JLCPCB Part Class: 扩展库; Datasheet: https://atta.szlcsc.com/upload/public/pdf/source/20221115/94102468E8C367463F1D717839C68408.pdf; Supplier: LCSC; Connector Type: Type-C; Gender: 母; Number of Contacts: 6P
U7 = SY8303AIC: 功能类型:降压型;输出类型:-;工作电压:4.5V~40V;输出电压:-;输出电流:-;; LCSC Part Name: 高效率快速响应3A 40V输入同步降压调节器; Supplier Part: C97054; Manufacturer: silergy(矽力杰); Supplier Footprint: TSOT-23-8; JLCPCB Part Class: 扩展库; Datasheet: https://atta.szlcsc.com/upload/public/pdf/source/20170308/1488958431714.pdf; Supplier: LCSC; Function: 降压型; Input Voltage: 4.5V~40V; Switching Frequency: 500kHz~2.5MHz; Operating Temperature: -40℃~+105℃; Synchronous Rectification: 是; Number of Outputs: 1; Topology: 降压式; Quiescent Current (Iq): 18uA
U13 = BL9110-330BPFB: LCSC Part Name: 输入6V 输出3.3V 1A; Supplier Part: C169246; Manufacturer: BL(上海贝岭); Supplier Footprint: SOT-223; JLCPCB Part Class: 扩展库; Datasheet: https://atta.szlcsc.com/upload/public/pdf/source/20180705/C248270_2CFF879E361E2024221F82A6F237DEBB.pdf; Supplier: LCSC; Output Type: 固定; Voltage - Supply: 6V; Output Voltage: 3.3V; Output Current: 1A; Power Supply Rejection Ratio (PSRR): 70dB@(1kHz); Voltage Dropout: 390mV@(1A); Features: 自动放电功能；热关断(TSD)；过流保护(OCP)；带使能; Output Configuration: 正极; Number of Outputs: 1
C40 C41 = GCJ188L8EL104KA07D: LCSC Part Name: 100nF ±10% 100V; Supplier Part: C710617; Manufacturer: muRata(村田); Supplier Footprint: 0603; JLCPCB Part Class: 扩展库; Datasheet: https://item.szlcsc.com/datasheet/GCJ188L8EL104KA07D/748889.html; Supplier: LCSC; Tolerance: ±10%; Voltage Rating: 100V; Temperature Coefficient: X8L
CN7 = B2B-XH-A(LF)(SN): LCSC Part Name: 1x2P 间距:2.5mm 直插 系列:XH; Supplier Part: C158012; Manufacturer: JST; Supplier Footprint: 插件,P=2.5mm; JLCPCB Part Class: 扩展库; Datasheet: https://item.szlcsc.com/datasheet/B2B-XH-A(LF)(SN)/169360.html; Supplier: LCSC; Pins Structure: 1x2P; Pitch: 2.5mm; Mounting Type: 直插; Reference Series: XH; Number of Pins: 2P; Number of Rows: 1; Number of PINs Per Row: 2; Current Rating: 3A; Contact Material: 黄铜; Contact Plating: 锡; Operating Temperature: -25℃~+85℃; Voltage Rating: 250V; Plastic Material: PA66; Flame Retardant Rating: UL94V-0; Supplementary Features: 打K脚; Color: 白色; Z-Height of the Board: 7mm; X-Length of Bottom Edge on Board (Spacing Line): 7.4mm; Y-Width of Bottom Edge on Board: 5.75mm
LED13 = KT-0603W: LCSC Part Name: 0603 白灯 高亮; Supplier Part: C2290; Manufacturer: KENTO; Supplier Footprint: 0603; JLCPCB Part Class: 基础库; Datasheet: https://item.szlcsc.com/datasheet/KT-0603W/2663.html; Supplier: LCSC; Illumination Color: 白色; Voltage - Forward(Vf): 2.6V~3.1V; Power(Watts): 100mW; Forward Current: 5mA; Luminous Intensity: 360mcd; Viewing Angle: 120°
R58-R61 = PTFR0603A10K0N9: LCSC Part Name: 薄膜电阻 10kΩ ±0.05% 100mW; Supplier Part: C47115530; Manufacturer: RESI(开步睿思); Supplier Footprint: 0603; JLCPCB Part Class: 扩展库; Datasheet: https://item.szlcsc.com/datasheet/PTFR0603A10K0N9/49305982.html; Supplier: LCSC; Type: 薄膜电阻; Tolerance: ±0.05%; Power(Watts): 100mW; Voltage-Supply(Max): 100V; Temperature Coefficient: ±10ppm/℃; Operating Temperature: -55℃~+155℃
R62 = AT0603BRE071KL: LCSC Part Name: 薄膜电阻 1kΩ ±0.1% 100mW; Supplier Part: C5555492; Manufacturer: YAGEO(国巨); Supplier Footprint: 0603; JLCPCB Part Class: 扩展库; Datasheet: https://item.szlcsc.com/datasheet/AT0603BRE071KL/6472105.html; Supplier: LCSC; Type: 薄膜电阻; Tolerance: ±0.1%; Power(Watts): 100mW; Voltage-Supply(Max): 75V; Temperature Coefficient: ±50ppm/℃; Operating Temperature: -55℃~+155℃
U11 = LM393: Supplier Part: C504553; Supplier Footprint: SOP-8; JLCPCB Part Class: 扩展库; Datasheet: https://atta.szlcsc.com/upload/public/pdf/source/20230406/A70798E4E4EECBB4A1C89323107B7C74.pdf; Supplier: LCSC

## Nets
24V: C44.2 C45.2 CN2.1 CN3.1 U7.5(IN) U7.8(EN)
GND: BUZZER1.2 C5.1 C19.1 C21.1 C22.1 C23.1 C28.1 C29.1 C32.1 C35.1 C36.1 C37.1 C38.1 C39.1 C40.1 C41.1 C42.1 C43.1 C44.1 C45.1 C46.1 C47.1 C48.1 C49.1 C50.1 CN2.2 CN3.2 CN5.1 CN5.3 CN5.4 CN6.1 CN6.3 CN6.4 CN7.1 H4.4 LED9.1(-) R7.1 R9.1 R47.1 R48.1 R54.1 R56.2 R60.1 R65.1 SW5.4 SW7.1 SW8.4 SW8.5 U2.2(VM) U2.3(VM) U2.4(VM) U3.9(EP) U6.1 U6.2 U6.3 U6.4 U6.A12(GND) U6.B12(GND) U7.3(GND) U7.4(GND) U9.8(VSSA) U9.23(VSS_1) U9.35(VSS_2) U9.44(BOOT0) U9.47(VSS_3) U11.4(GND) U13.1(GND) X1.2(GND) X1.4(GND)
VCC0: C35.2 C36.2 C37.2 C38.2 C39.2 C40.2 C47.2 H4.1 LED13.1(A) R10.1 R52.2 R53.2 R58.2 R59.2 R61.2 U9.9(VDDA) U9.24(VDD_1) U9.36(VDD_2) U9.48(VDD_3) U11.8(VDD) U13.4(VOUT)
VIN: C22.2 R41.2 U3.1(VIN) U6.A9(VBUS) U6.B9(VBUS)
ADC1_IN4: R64.1 R65.2 U9.14(PA4)
BAT_OUT: C48.2 C49.2 C50.2 SW1.3 U3.8(VOUT)
BATTERY_GND: BT1.1 C19.2 C20.1 U2.5(GND) U2.7(GND) U2.8(GND) U2.9(EP)
BATTERY_VBAT: BT1.2 C29.2 L4.2 R13.1 R42.2 R64.2
BUCK_OUT: C5.2 C7.2 C46.2 L3.2 R49.2 SW1.1
NRST: C32.2 R52.1 SW7.2 U9.7(NRST)
OSC_IN: C42.2 U9.5(PD0-OSC_IN) X1.3
OSC_OUT: C43.2 U9.6(PD1-OSC_OUT) X1.1
PB1: R61.1 R62.1 U9.19(PB1) U11.7
PB2: BUZZER1.1 U9.20(PB2)
RED_BLUE_JUDGE: SW8.2 U9.18(PB0)
SWCLK: H4.3 R54.2 U9.37(PA14)
SWDIO: H4.2 R53.1 U9.34(PA13)
TIM2_CH1: CN5.2 U9.10(PA0-WKUP)
TIM2_CH2: CN6.2 U9.11(PA1)
USER_PWOER: SW1.2 U13.3(VDD)
$1N2474: C28.2 R42.1 U3.6(BAT)
$1N2475: L4.1 U3.7(SW)
$1N2486: R45.2 R46.2 U3.3(LED2)
$1N2487: LED3.1(C) LED4.2(A) LED5.1(C) LED6.2(A) U3.4(LED3)
$1N2490: R43.2 R44.2 U3.2(LED1)
$1N2494: C20.2 R13.2 U2.6(VDD)
$1N2500: LED6.1(C) R46.1
$1N2501: LED5.2(A) R45.1
$1N2502: LED4.1(C) R44.1
$1N2503: LED3.2(A) R43.1
$1N2504: C23.2 R41.1
$1N2907: R47.2 U6.A5(CC1)
$1N2911: R48.2 U6.B5(CC2)
$1N3566: C8.2 L3.1 U7.6(LX)
$1N3570: C8.1 U7.7(BS)
$1N3574: R9.2 U7.2(FS)
$1N3650: LED9.2(+) R10.2
$1N3729: C7.1 R7.2 R49.1 U7.1(FB)
$1N10525: R63.2 U3.5(KEY)
$1N10529: C21.2 R63.1 SW5.1
$2N2480: R56.1 SW8.3
$3N487: R59.1 R60.2 U11.5
$3N1031: C41.2 CN7.2 R58.1 U11.6
$3N1312: LED13.2(K) R62.2

Not connected (* = marked no-connect by the designer): SW5 2* 3*; SW8 1*; U2 1(NC)*; U9 1(VBAT)* 2(PC13-TAMPER-RTC)* 3(PC14-OSC32_IN)* 4(PC15-OSC32_OUT)* 12(PA2)* 13(PA3)* 15(PA5)* 16(PA6)* 17(PA7)* 21(PB10)* 22(PB11)* 25(PB12)* 26(PB13)* 27(PB14)* 28(PB15)* 29(PA8)* 30(PA9)* 31(PA10)* 32(PA11)* 33(PA12)* 38(PA15)* 39(PB3)* 40(PB4)* 41(PB5)* 42(PB6)* 43(PB7)* 45(PB8)* 46(PB9)*; U11 1* 2* 3*; U13 2(VOUT)

## Notes on the sheets
sheet 1
- 滑动开关
  滑动到一侧时是内部供电模式（开启绿灯）
  滑动到另一侧是外部供电模式（初始不亮灯，默认关闭，
  接24V电后亮绿灯）
- XT30进电
- 24-5
- 电池接入+保护
- 电池典型电压为3.7V
  充满为4.2V
- P+
- LDO 芯片电源
- 防止过充与过放
- 保护电池
- P-
- 电池充电电路
- M3螺丝孔
sheet 2
- 晶振电路
- STM32F103CBT6芯片电路
- 复位电路
- PWM接口
- 下载电路
- 开机默认是红色 PB0内部上拉
  检测PB0引脚是否拉低
  如果被拉低则改成蓝色
- 震动+电压比较器输出链接PB1
- 蜂鸣器
- ADC检测
sheet 3
- 振动传感器检测电路
- 由电压比较器实现
- 座子 用来接震动传感器

# Board PCB1
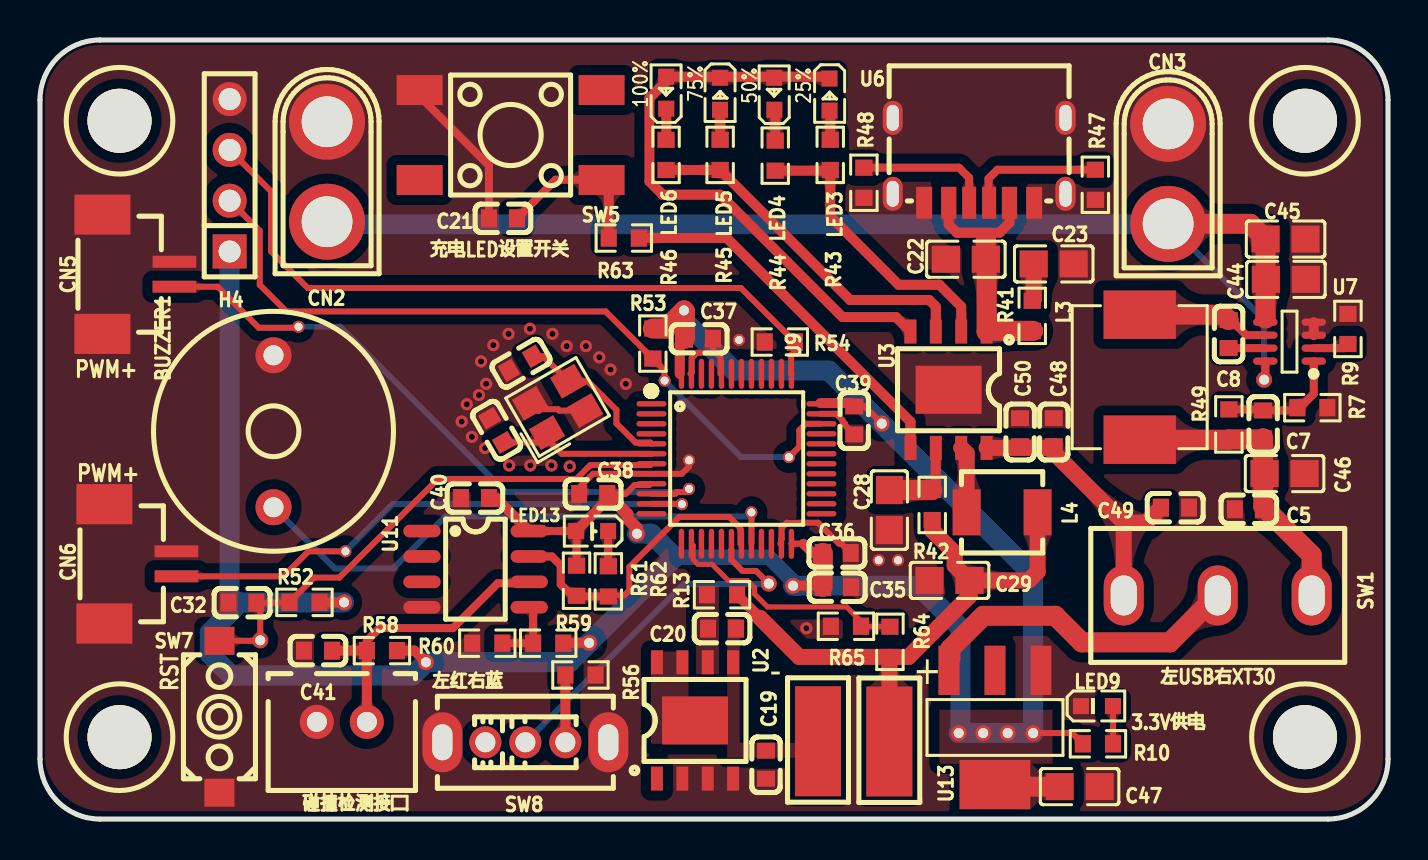
[diagram p3: board, top side]
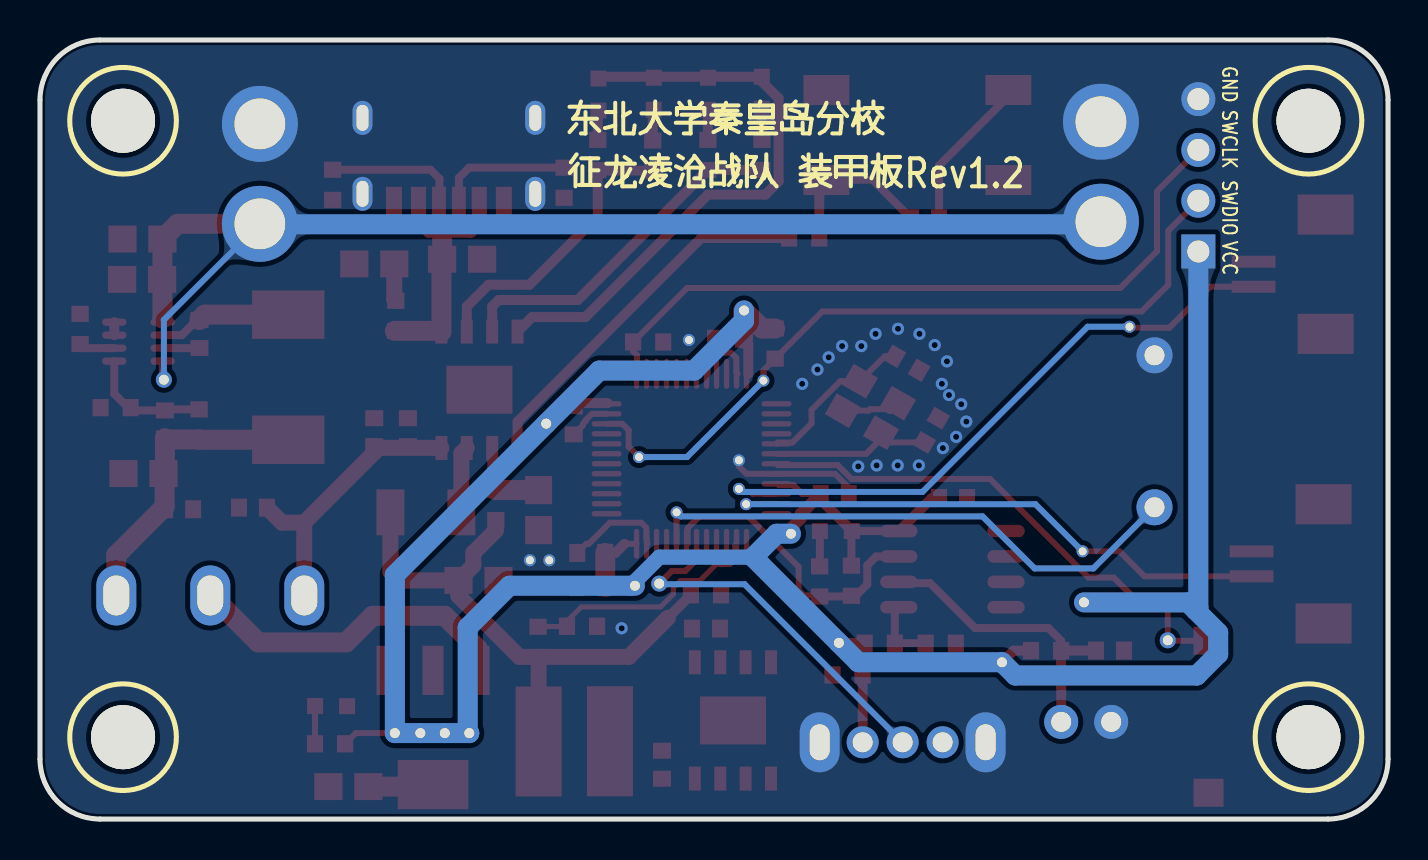
[diagram p4: board, bottom side, seen from below]

Outline 67.42 x 38.96 mm; copper layers: Top Layer, Bottom Layer. Coordinates in mm from the lower left corner of the outline.
Outline path: 0,35.96 0,3 arc(0.88,0.88) 3,0 64.42,0 arc(66.54,0.88) 67.42,3 67.42,35.96 arc(66.54,38.09) 64.42,38.96 3,38.96 arc(0.88,38.09) 0,35.96
Stack: Top Layer 0.035mm / Dielectric1 1.51mm FR4 er 4.5 / Bottom Layer 0.035mm

## Design rules (mm)
template: 自定义配置
spacing copperThickness1oz (default): track to track 0.102, other pairs 0.152 to 0.3
spacing copperThickness2oz: track to track 0.203, other pairs 0.152 to 0.3
track width copperThickness1oz (default): min 0.127, default 0.254, max 2.54
track width copperThickness2oz: min 0.203, default 0.254, max 2.54
differential pair differentialPair (default): width min 0.127, default 0.254, max 2.54; gap min 0.152, default 0.152
via viaSize (default): diameter min 0.5, default 0.61, max 10; hole min 0.3, default 0.305, max 6.3
pour e1329 uses copperRegion1

## Placement (name value [footprint] x y rotation side)
BT1  BH-18650-B1BA002  [Battery]  38.91 3.89 90 top
BUZZER1  2.4kHz  [BUZ-TH_BD12.0-P7.60-D0.6-FD]  11.68 19.4 90 top
C5  100nF  [C0603]  60.46 15.49 0 top
C7  100nF  [C0603]  61.18 19.74 270 top
C8  10nF  [C0603]  59.45 24.26 90 top
C19  2.2uF  [C0603]  36.31 2.72 90 top
C20  4.7uF  [C0603]  34.11 9.52 180 top
C21  100nF  [C0603]  23.15 30.04 0 top
C22  10uF  [C0805]  46.31 28 0 top
C23  10uF  [C0805]  50.7 27.76 180 top
C28  22uF  [C0805]  42.48 15.45 90 top
C29  22uF  [C0805]  45.49 11.94 0 top
C32  100nF  [C0603]  10.12 10.82 0 top
C35  100nF  [C0603]  39.85 13.31 180 top
C36  100nF  [C0603]  39.87 11.6 180 top
C37  100nF  [C0603]  32.96 24.03 180 top
C38  100nF  [C0603]  27.67 16.26 0 top
C39  100nF  [C0603]  40.73 19.94 90 top
C40  100nF  [C0603]  21.75 16.05 0 top
C41  100nF  [C0603]  13.9 8.42 0 top
C42  20pF  [C0603]  24.06 22.8 30 top
C43  20pF  [C0603]  22.84 19.44 300 top
C44  100nF  [C0805]  62.31 26.99 180 top
C45  4.7uF  [C0805]  62.3 29.01 180 top
C46  47uF  [C0805]  62.25 17.28 180 top
C47  47uF  [C0805]  52 1.62 180 top
C48  22uF  [C0603]  50.7 19.35 270 top
C49  22uF  [C0603]  56.77 15.57 180 top
C50  22uF  [C0603]  49.02 19.35 270 top
CN2  XT30U-M  [CONN-TH_XT30U-M]  14.36 32.38 90 top
CN3  XT30U-F  [CONN-TH_XT30U-M]  56.43 32.27 90 top
CN5  X1251WVS-02HF-LPSW  [郭哥CAN2脚母接口]  4.79 27.25 270 top
CN6  X1251WVS-02HF-LPSW  [郭哥CAN2脚母接口]  4.9 12.77 270 top
CN7  B2B-XH-A(LF)(SN)  [CONN-TH_B2B-XH-A-LF-SN]  15.1 4.86 180 top
H4  -  [HDR-TH_4P-P2.54-V-M]  9.49 32.2 90 top
L3  10uH  [IND-SMD_L7.0-W6.6_FXL0630]  55 22.1 90 top
L4  1uH  [IND-SMD_L4.5-W4.1_SL0420]  48.12 15.34 0 top
LED3  -  [LED_0603]  39.5 36.19 270 top
LED4  -  [LED_0603]  36.72 36.33 90 top
LED5  -  [LED_0603]  34.02 36.23 270 top
LED6  -  [LED_0603]  31.31 36.38 90 top
LED9  LED,green  [LED0603-RD_GREEN]  52.86 5.65 0 top
LED13  KT-0603W  [LED0603-R-RD_WHITE]  27.62 14.41 180 top
M1  M3  [m3螺丝孔]  63.27 34.92 0 top
M2  M3  [m3螺丝孔]  3.98 4.09 0 top
M3  M3  [m3螺丝孔]  63.27 4.09 0 top
M4  M3  [m3螺丝孔]  3.98 34.92 0 top
NOREF  -  [Pad_e1791]  29.86 14.27 0 top
NOREF#2  -  [Pad_e1321]  15.21 10.84 0 top
NOREF#3  -  [Pad_e229]  36.45 11.78 0 top
NOREF#4  -  [Pad_e1298]  42.1 19.78 0 top
NOREF#5  -  [Pad_e5621]  34.96 23.96 0 top
NOREF#6  -  [Pad_e98]  61.23 21.97 0 top
NOREF#7  -  [Pad_e534]  11.02 8.94 0 top
NOREF#8  -  [Pad_e305]  48.4 4.3 0 top
NOREF#9  -  [Pad_e304]  47.18 4.3 0 top
NOREF#10  -  [Pad_e1305]  32.21 25.44 0 top
NOREF#11  -  [Pad_e302]  45.95 4.3 0 top
NOREF#12  -  [Pad_e1312]  37.67 11.67 0 top
NOREF#13  -  [Pad_e638]  37.46 18.1 0 top
NOREF#14  -  [Pad_e1326]  27.47 8.81 0 top
NOREF#15  -  [Pad_e1987]  12.93 24.62 0 top
NOREF#16  -  [Pad_e1322]  19.31 7.84 0 top
NOREF#17  -  [Pad_e1994]  15.28 13.39 0 top
NOREF#18  -  [Pad_e306]  49.67 4.3 0 top
NOREF#19  -  [Pad_e2700]  32.46 17.94 0 top
NOREF#20  -  [Pad_e2203]  42.92 12.94 0 top
NOREF#21  -  [Pad_e2202]  41.95 12.94 0 top
NOREF#22  -  [Pad_e135]  35.58 15.34 0 top
NOREF#23  -  [Pad_e1914]  32.11 15.75 0 top
NOREF#24  -  [Pad_e633]  31.24 21.93 0 top
NOREF#25  -  [Pad_e1913]  32.46 16.51 0 top
R7  22kΩ  [R0603]  63.64 20.58 180 top
R9  200kΩ  [R0603]  65.42 24.51 270 top
R10  1kΩ  [R0603]  52.92 3.76 0 top
R13  100R  [R0603]  34.11 11.22 180 top
R41  2Ω  [R0603]  49.63 25.17 270 top
R42  500mΩ  [R0603]  44.63 15.71 270 top
R43  1K  [R0603]  39.53 33.22 270 top
R44  1K  [R0603]  36.77 33.18 270 top
R45  1K  [R0603]  34.02 33.22 270 top
R46  1K  [R0603]  31.31 33.22 270 top
R47  5.1kΩ  [R0603]  52.79 31.72 90 top
R48  5.1kΩ  [R0603]  41.21 31.82 90 top
R49  160kΩ  [R0603]  59.46 19.74 270 top
R52  10kΩ  [R0603]  13.23 10.84 0 top
R53  10kΩ  [R0603]  30.65 23.78 90 top
R54  10kΩ  [R0603]  37 23.86 0 top
R56  1kΩ  [R0603]  27.03 7.21 0 top
R58  10kΩ  [R0603]  17.1 8.42 0 top
R59  10kΩ  [R0603]  25.42 8.79 0 top
R60  10kΩ  [R0603]  22.37 8.79 0 top
R61  10kΩ  [R0603]  26.84 11.92 90 top
R62  1kΩ  [R0603]  28.43 11.89 90 top
R63  10kΩ  [R0603]  29.2 29.06 0 top
R64  10kΩ  [R0603]  42.51 8.86 270 top
R65  10kΩ  [R0603]  40.31 9.64 0 top
SW1  SS-12D10L5  [SW-TH_SS-12D10L5]  58.91 11.18 180 top
SW5  KH-6X6X5H-STM  [SW-SMD_4P-L6.0-W6.0-P4.50-LS9.0_H5.0]  23.54 34.21 180 top
SW7  K2-1107ST-A4DW-06  [KEY-SMD_L6.2-W3.6-LS8.0]  8.98 5.12 90 top
SW8  SS12D07VG4 087  [SW-TH_SS12D07VG4]  24.28 3.84 0 top
U2  IP3005A  [ESOP-8_L4.9-W3.9-P1.27-LS6.0-BL-EP]  32.76 4.93 0 top
U3  IP5306  [ESOP-8_L4.9-W3.9-P1.27-LS6.0-BL-EP]  45.44 21.47 180 top
U6  YTC-TC6-268  [TYPE-C-SMD_YIYUAN_YTC-TC6-268]  46.97 32.95 180 top
U7  SY8303AIC  [TSOT-23-8_L2.9-W1.6-P0.65-LS2.8-BR]  62.5 23.88 0 top
U9  STM32F103C8T6  [LQFP-48_L7.0-W7.0-P0.50-LS9.0-BL]  34.83 18.02 270 top
U11  LM393  [SOP-8_L4.9-W3.9-P1.27-LS6.0-BL]  21.79 12.5 270 top
U13  BL9110-330BPFB  [SOT-223_L6.5-W3.5-P2.30-LS7.0-BR]  47.76 4.58 90 top
X1  8MHz  [CRYSTAL-SMD_4P-L3.2-W2.5-BL]  25.89 20.61 30 top

## Footprints (pads in the part's own frame, mm; a bottom-side part is the same pattern mirrored in y, then rotated)
Battery
  rect 5.5x2.3 smd: 1(0,0) 2(-0.013,-3.568)
BUZ-TH_BD12.0-P7.60-D0.6-FD
  round 1.8 hole 1: 1(-3.8,0) 2(3.8,0)
C0603
  rect 0.8x0.9 smd: 1(-0.7,0) 2(0.7,0)
C0805
  rect 1.41x1.35 smd: 1(-1,0) 2(1,0)
CONN-TH_B2B-XH-A-LF-SN
  round 1.7 hole 1: 1(1.25,0) 2(-1.25,0)
CONN-TH_XT30U-M
  round 3.8 hole 2.54: 1(-2.5,0) 2(2.5,0)
CRYSTAL-SMD_4P-L3.2-W2.5-BL
  rect 1.4x1.2 smd: 1(-1.1,-0.85) 2(1.1,-0.85) 3(1.1,0.85) 4(-1.1,0.85)
ESOP-8_L4.9-W3.9-P1.27-LS6.0-BL-EP
  rect 0.6x1.2 smd: 1(-1.905,-2.909) 2(-0.635,-2.909) 3(0.635,-2.909) 4(1.905,-2.909) 5(1.905,2.909) 6(0.635,2.909) 7(-0.635,2.909) 8(-1.905,2.909)
  rect 3.3x2.4 smd: 9(0,0)
HDR-TH_4P-P2.54-V-M
  rect 1.7x1.7 hole 1.1: 1(-3.81,0)
  round 1.7 hole 1.1: 2(-1.27,0) 3(1.27,0) 4(3.81,0)
IND-SMD_L4.5-W4.1_SL0420
  rect 1.4x2.3 smd: 1(-1.775,0) 2(1.775,0)
IND-SMD_L7.0-W6.6_FXL0630
  rect 2.424x3.62 smd: 1(3.128,0) 2(-3.128,0)
KEY-SMD_L6.2-W3.6-LS8.0
  rect 1.4x1.5 smd: 1(-3.8,0) 2(3.8,0)
LED0603-R-RD_WHITE
  rect 0.8x0.8 smd: 1(0.8,0) 2(-0.8,0)
LED0603-RD_GREEN
  rect 0.8x0.8 smd: 1(-0.799,-0.004) 2(0.799,0.004)
LED_0603
  rect 0.8x0.8 smd: 1(-0.851,-0.01) 2(0.75,-0.005)
LQFP-48_L7.0-W7.0-P0.50-LS9.0-BL
  oval 0.27x1.5 smd: 1(-2.75,-4.25) 2(-2.25,-4.25) 3(-1.75,-4.25) 4(-1.25,-4.25) 5(-0.75,-4.25) 6(-0.25,-4.25) 7(0.25,-4.25) 8(0.75,-4.25) 9(1.25,-4.25) 10(1.75,-4.25) 11(2.25,-4.25) 12(2.75,-4.25) 25(2.75,4.25) 26(2.25,4.25) 27(1.75,4.25) 28(1.25,4.25) 29(0.75,4.25) 30(0.25,4.25) 31(-0.25,4.25) 32(-0.75,4.25) 33(-1.25,4.25) 34(-1.75,4.25) 35(-2.25,4.25) 36(-2.75,4.25)
  oval 1.5x0.27 smd: 13(4.25,-2.75) 14(4.25,-2.25) 15(4.25,-1.75) 16(4.25,-1.25) 17(4.25,-0.75) 18(4.25,-0.25) 19(4.25,0.25) 20(4.25,0.75) 21(4.25,1.25) 22(4.25,1.75) 23(4.25,2.25) 24(4.25,2.75) 37(-4.25,2.75) 38(-4.25,2.25) 39(-4.25,1.75) 40(-4.25,1.25) 41(-4.25,0.75) 42(-4.25,0.25) 43(-4.25,-0.25) 44(-4.25,-0.75) 45(-4.25,-1.25) 46(-4.25,-1.75) 47(-4.25,-2.25) 48(-4.25,-2.75)
m3螺丝孔
  round 3.2 hole 3.2: 1(0,0)
Pad_e98
  round 0.8 hole 0.5: 1(0,0)
Pad_e135
  round 0.6 hole 0.4: 1(0,0)
Pad_e229
  round 0.8 hole 0.5: 1(0,0)
Pad_e302
  round 0.8 hole 0.5: 1(0,0)
Pad_e304
  round 0.8 hole 0.5: 1(0,0)
Pad_e305
  round 0.8 hole 0.5: 1(0,0)
Pad_e306
  round 0.8 hole 0.5: 1(0,0)
Pad_e534
  round 0.8 hole 0.5: 1(0,0)
Pad_e633
  round 0.6 hole 0.4: 1(0,0)
Pad_e638
  round 0.6 hole 0.4: 1(0,0)
Pad_e1298
  round 0.8 hole 0.5: 1(0,0)
Pad_e1305
  round 0.8 hole 0.5: 1(0,0)
Pad_e1312
  round 0.8 hole 0.5: 1(0,0)
Pad_e1321
  round 0.8 hole 0.5: 1(0,0)
Pad_e1322
  round 0.8 hole 0.5: 1(0,0)
Pad_e1326
  round 0.8 hole 0.5: 1(0,0)
Pad_e1791
  round 0.8 hole 0.5: 1(0,0)
Pad_e1913
  round 0.6 hole 0.4: 1(0,0)
Pad_e1914
  round 0.6 hole 0.4: 1(0,0)
Pad_e1987
  round 0.6 hole 0.4: 1(0,0)
Pad_e1994
  round 0.6 hole 0.4: 1(0,0)
Pad_e2202
  round 0.6 hole 0.4: 1(0,0)
Pad_e2203
  round 0.6 hole 0.4: 1(0,0)
Pad_e2700
  round 0.6 hole 0.4: 1(0,0)
Pad_e5621
  round 0.6 hole 0.4: 1(0,0)
R0603
  rect 0.806x0.864 smd: 1(-0.753,0) 2(0.753,0)
SOP-8_L4.9-W3.9-P1.27-LS6.0-BL
  oval 0.63x1.865 smd: 1(-1.905,-2.683) 2(-0.635,-2.683) 3(0.635,-2.683) 4(1.905,-2.683) 5(1.905,2.683) 6(0.635,2.683) 7(-0.635,2.683) 8(-1.905,2.683)
SOT-223_L6.5-W3.5-P2.30-LS7.0-BR
  rect 2.465x1.05 smd: 1(2.857,-2.3) 2(2.857,0) 3(2.857,2.3)
  rect 2.465x3.54 smd: 4(-2.857,0)
SW-SMD_4P-L6.0-W6.0-P4.50-LS9.0_H5.0
  rect 2.3x1.5 smd: 1(-4.55,2.25) 2(4.55,2.25) 3(-4.55,-2.25) 4(4.55,-2.25)
SW-TH_SS12D07VG4
  oval 1.6x1.6 hole 1: 1(-2,0) 2(0,0) 3(2,0)
  oval 2x3 hole 1x1.8: 4(4.15,0) 5(-4.15,0)
SW-TH_SS-12D10L5
  oval 2x3 hole 1.3x2: 1(-4.7,0) 2(0,0) 3(4.7,0)
TSOT-23-8_L2.9-W1.6-P0.65-LS2.8-BR
  oval 1.222x0.364 smd: 1(1.211,-0.975) 2(1.211,-0.325) 3(1.211,0.325) 4(1.211,0.975) 5(-1.211,0.975) 6(-1.211,0.325) 7(-1.211,-0.325) 8(-1.211,-0.975)
TYPE-C-SMD_YIYUAN_YTC-TC6-268
  oval 1x1.7 hole 0.6x1.3: 1(-4.32,1.675) 2(4.32,1.675) 3(4.32,-2.124) 4(-4.32,-2.124)
  rect 0.7x1.6 smd: A5(-0.5,2.124) B5(0.5,2.124)
  rect 0.76x1.6 smd: A9(1.52,2.124) B9(-1.52,2.124)
  rect 0.8x1.6 smd: A12(2.75,2.124) B12(-2.75,2.124)
郭哥CAN2脚母接口
  rect 0.6x2.184 smd: 1(-0.625,1.929) 2(0.625,1.929)
  rect 2.006x2.8 smd: 3(2.983,-1.675) 4(-2.983,-1.675)

## Nets
24V: C44.2 C45.2 CN2.1 CN3.1 NOREF#6.1 U7.5 U7.8
GND: BUZZER1.2 C5.1 C19.1 C21.1 C22.1 C23.1 C28.1 C29.1 C32.1 C35.1 C36.1 C37.1 C38.1 C39.1 C40.1 C41.1 C42.1 C43.1 C44.1 C45.1 C46.1 C47.1 C48.1 C49.1 C50.1 CN2.2 CN3.2 CN5.1 CN5.3 CN5.4 CN6.1 CN6.3 CN6.4 CN7.1 H4.4 LED9.1 NOREF#5.1 NOREF#19.1 NOREF#20.1 NOREF#21.1 R7.1 R9.1 R47.1 R48.1 R54.1 R56.2 R60.1 R65.1 SW5.4 SW7.1 SW8.4 SW8.5 U2.2 U2.3 U2.4 U3.9 U6.1 U6.2 U6.3 U6.4 U6.A12 U6.B12 U7.3 U7.4 U9.8 U9.23 U9.35 U9.44 U9.47 U11.4 U13.1 X1.2 X1.4
VCC0: C35.2 C36.2 C37.2 C38.2 C39.2 C40.2 C47.2 H4.1 LED13.1 NOREF.1 NOREF#2.1 NOREF#4.1 NOREF#8.1 NOREF#9.1 NOREF#10.1 NOREF#11.1 NOREF#12.1 NOREF#14.1 NOREF#16.1 NOREF#18.1 R10.1 R52.2 R53.2 R58.2 R59.2 R61.2 U9.9 U9.24 U9.36 U9.48 U11.8 U13.4
VIN: C22.2 R41.2 U3.1 U6.A9 U6.B9
ADC1_IN4: R64.1 R65.2 U9.14
BAT_OUT: C48.2 C49.2 C50.2 SW1.3 U3.8
BATTERY_GND: BT1.1 C19.2 C20.1 U2.5 U2.7 U2.8 U2.9
BATTERY_VBAT: BT1.2 C29.2 L4.2 R13.1 R42.2 R64.2
BUCK_OUT: C5.2 C7.2 C46.2 L3.2 R49.2 SW1.1
NRST: C32.2 NOREF#7.1 R52.1 SW7.2 U9.7
OSC_IN: C42.2 U9.5 X1.3
OSC_OUT: C43.2 U9.6 X1.1
PB1: R61.1 R62.1 U9.19 U11.7
PB2: BUZZER1.1 NOREF#22.1 U9.20
RED_BLUE_JUDGE: NOREF#3.1 SW8.2 U9.18
SWCLK: H4.3 R54.2 U9.37
SWDIO: H4.2 NOREF#13.1 NOREF#24.1 R53.1 U9.34
TIM2_CH1: CN5.2 NOREF#15.1 NOREF#25.1 U9.10
TIM2_CH2: CN6.2 NOREF#17.1 NOREF#23.1 U9.11
USER_PWOER: SW1.2 U13.3
$1N2474: C28.2 R42.1 U3.6
$1N2475: L4.1 U3.7
$1N2486: R45.2 R46.2 U3.3
$1N2487: LED3.1 LED4.2 LED5.1 LED6.2 U3.4
$1N2490: R43.2 R44.2 U3.2
$1N2494: C20.2 R13.2 U2.6
$1N2500: LED6.1 R46.1
$1N2501: LED5.2 R45.1
$1N2502: LED4.1 R44.1
$1N2503: LED3.2 R43.1
$1N2504: C23.2 R41.1
$1N2907: R47.2 U6.A5
$1N2911: R48.2 U6.B5
$1N3566: C8.2 L3.1 U7.6
$1N3570: C8.1 U7.7
$1N3574: R9.2 U7.2
$1N3650: LED9.2 R10.2
$1N3729: C7.1 R7.2 R49.1 U7.1
$1N10525: R63.2 U3.5
$1N10529: C21.2 R63.1 SW5.1
$2N2480: R56.1 SW8.3
$3N487: R59.1 R60.2 U11.5
$3N1031: C41.2 CN7.2 R58.1 U11.6
$3N1312: LED13.2 R62.2

Pads without a net: M1 1; M2 1; M3 1; M4 1; SW5 2 3; SW8 1; U2 1; U9 1 2 3 4 12 13 15 16 17 21 22 25 26 27 28 29 30 31 32 33 38 39 40 41 42 43 45 46; U11 1 2 3; U13 2

## Via types
v1: diameter 0.61, hole 0.305, Top Layer to Bottom Layer, 21 vias

## Routing (per net, layer and track width the routed paths; a pad name or vN(x,y) marks a point on that pad's centre or on a via; arc(x,y) is an arc through that point)
24V: length 62.4
  Top Layer w0.4: NOREF#6.1 61.29,22.03 U7.8
  Top Layer w1: 61.29,25.04 61.3,25.05 C45.2 60.54,29.77 CN3.1
  Bottom Layer w0.3: NOREF#6.1 61.23,24.97 CN3.1
  Bottom Layer w1: CN3.1 56.4,29.75 13.97,29.75
GND: length 29.4
  Top Layer w0.3: 37.03,13.77 37.07,13.8 37.07,13.98 37.1,14 37.1,14.56 37.35,14.82 38.92,14.82 39.97,13.77 40.09,13.77 C35.1 ; 39.03,20.27 39.82,20.27 40.14,19.95 40.14,19.9 40.27,19.77 40.27,19.7 C39.1 ; 33.58,23.32 33.82,23.32 34.03,23.11 34.03,22.27 ; 33.58,23.32 32.85,23.32 32.6,23.06 32.6,22.33 32.53,22.27 ; 33.58,23.32 33.66,23.39 C37.1 ; 30.53,17.27 27.66,17.27 26.97,16.58 C38.1 ; X1.2 25.97,20.43 25.9,20.5 25.03,20.5 24.96,20.43 24.88,20.43 X1.4 ; NOREF#19.1 32.46,17.64 32.1,17.27 U9.8
  Top Layer w0.4: C21.1 22.45,32.68 18.66,36.48
  Top Layer w0.5: U7.3 U7.4
  vias: v1(21.09,19.88) v1(21.35,20.75) v1(21.6,19.11) v1(21.96,21.21) v1(22.06,22.89) v1(22.26,18.55) v1(22.31,21.77) v1(22.67,23.7) v1(23.44,24.27) v1(23.46,17.69) v1(24.51,24.52) v1(24.52,17.69) v1(25.63,24.27) v1(25.58,17.69) v1(26.34,23.65) v1(26.5,17.64) v1(27.3,23.65) v1(27.98,23.09) v1(28.54,22.48) v1(29.3,21.77) v1(38.33,9.54)
VCC0: length 149.3
  Top Layer w0.3: 30.53,16.77 30.47,16.7 29.74,16.7 29.29,16.26 C38.2 ; U9.24 38.18,13.77 ; C39.2 41.24,20.64 42.05,19.83 42.21,19.83 ; R10.1 51.63,4.3 NOREF#18.1
  Top Layer w0.4: R61.2 26.84,14.39 LED13.1 ; 26.81,14.4 24.52,14.4
  Top Layer w0.5: LED13.1 28.37,15.96 C38.2 ; R59.2 26.19,8.81 NOREF#14.1 ; R58.2 18.73,8.42 NOREF#16.1 ; C37.2 32,23.76 32,22.27 ; C40.2 22.82,16.05 U11.8 ; C39.2 40.56,20.81 39.03,20.81 ; C35.2 38.64,13.31 38.18,13.77 ; 39.17,11.6 39.1,11.67 NOREF#12.1 ; R52.2 NOREF#2.1
  Top Layer w0.6: NOREF.1 29.86,14.54 29.38,15.03 29.38,15.25 C38.2
  Top Layer w1: C37.2 32.26,25.39 NOREF#10.1 31.3,24.53 R53.2 ; C47.2 47.86,1.62 U13.4 ; C35.2 39.15,11.61
  Bottom Layer w0.762: 37.88,11.67 36.45,13.1 31.75,13.1
  Bottom Layer w1: H4.1 9.49,10.58 9.62,10.45 ; NOREF#2.1 10.01,10.84 9.62,10.45 ; NOREF.1 30.58,14.27 31.75,13.1 NOREF#14.1 26.5,7.84 NOREF#16.1 18.64,7.18 9.56,7.18 8.49,8.25 8.49,9.32 9.62,10.45 ; NOREF#10.1 32.21,24.93 34.71,22.43 39.45,22.43 NOREF#4.1 49.67,12.21 NOREF#18.1 NOREF#8.1 NOREF#9.1 NOREF#11.1 46.03,4.38 46.03,9.58 43.94,11.67 NOREF#12.1
VIN: length 12.5
  Top Layer w0.5: 45.45,30.82 45.45,29.73 45.86,29.33 47.99,29.33 48.49,29.83 48.49,30.82
  Top Layer w1: 49.67,24.42 47.38,24.42 U3.1 47.35,27.96 C22.2 47.31,29.02
ADC1_IN4: length 12.2
  Top Layer w0.254: R64.1 42.5,9.63 41.33,9.63 40.35,10.61 36.39,10.61 35.74,11.26 35.74,11.58 35.39,11.93 34.42,11.93 33.61,12.74 32.91,12.74 32.67,12.98 32.67,13.68 U9.14
BAT_OUT: length 14.5
  Top Layer w0.8: C49.2 55.32,14.83 54.21,14.83 ; 54.21,14.83 50.7,18.33 C48.2 50.62,18.56 U3.8 ; 54.21,14.83 SW1.3
BATTERY_VBAT: length 29.5
  Top Layer w0.5: 34.87,11.22 36.01,10.07 36.01,10.07
  Top Layer w0.8: R64.2 43.44,8.11 46.49,11.16 C29.2 ; R64.2 42.48,8.08 BT1.2 ; R64.2 37.97,8.11 36.01,10.07 ; R42.2 44.63,14.43 45.75,13.31 45.75,12.68 C29.2 ; L4.2 49.9,12.37 49.46,11.94 C29.2
BUCK_OUT: length 15
  Top Layer w1: L3.2 59.45,18.97 59.46,18.98 61.12,18.98 C7.2 61.18,17.37 61.19,17.36 61.19,15.67 ; 61.19,15.62 63.61,13.2 SW1.1
NRST: length 26.6
  Top Layer w0.3: U9.7 30.52,17.7 27.53,17.7 26.83,17.01 19.9,17.01 14.97,12.08 13.71,12.08 R52.1 ; 12.42,10.84 12.42,10.82 C32.2 11.02,10.62 NOREF#7.1 10.99,8.92 SW7.2
OSC_IN: length 8.1
  Top Layer w0.3: U9.5 30.52,18.83 29.79,18.83 28.83,19.79 28.83,20.46 27.4,21.9 26.42,21.9 25.17,23.15 24.67,23.15
OSC_OUT: length 8.2
  Top Layer w0.3: C43.2 24.87,18.84 X1.1 25.36,19.01 26.1,18.27 U9.6
PB1: length 15.2
  Top Layer w0.3: 35.03,13.77 35.03,14.5 35.02,14.51 35.02,14.56 34.47,15.11 31.98,15.11 29.48,12.61 29.48,11.44 29.23,11.19 28.48,11.19 R62.1
  Top Layer w0.4: R62.1 26.87,11.13 R61.1 26.62,11.17 26.05,11.74 26.05,12.69 25.6,13.13 24.52,13.13
PB2: length 27.9
  Top Layer w0.3: U9.20 NOREF#22.1
  Bottom Layer w0.3: NOREF#22.1 35.38,15.14 20.27,15.14 17.67,12.54 14.74,12.54 BUZZER1.1
RED_BLUE_JUDGE: length 18.1
  Top Layer w0.3: 34.58,13.46 34.58,13.46 34.58,12.97 35.14,12.41 35.82,12.41 36.31,11.91 36.31,11.75
  Bottom Layer w0.3: SW8.2 32.18,11.75 36.31,11.75
SWCLK: length 35.7
  Top Layer w0.3: U9.37 37.56,22.29 37.56,23.2 37.76,23.39 37.76,23.86 35.05,26.56 13.39,26.56 11.55,28.4 11.55,31.4 H4.3
SWDIO: length 37.9
  Top Layer w0.3: H4.2 10.99,29.42 10.99,26.71 12.32,25.39 28.29,25.39 R53.1 31.24,22.44 NOREF#24.1 ; NOREF#13.1 37.98,18.62 37.98,19.45 38.3,19.77 39.03,19.77
  Bottom Layer w0.3: NOREF#24.1 35.07,18.1 NOREF#13.1
TIM2_CH1: length 32.1
  Top Layer w0.3: NOREF#15.1 12.88,24.57 10.94,24.57 8.89,26.62 6.72,26.62 ; U9.10 31.78,16.27 31.86,16.35 32.3,16.35 NOREF#25.1
  Bottom Layer w0.3: NOREF#25.1 32.31,16.36 23.28,16.36 15.02,24.62 NOREF#15.1
TIM2_CH2: length 28.3
  Top Layer w0.3: CN6.2 12.18,12.14 13.43,13.39 NOREF#17.1 ; U9.11 32.09,15.77 NOREF#23.1
  Bottom Layer w0.3: NOREF#23.1 17.64,15.75 NOREF#17.1
USER_PWOER: length 16.1
  Top Layer w1: SW1.2 58.86,11.13 58.8,11.13 56.51,8.84 52.11,8.84 50.78,10.16 47.18,10.16 45.53,8.52 45.53,8.04 45.48,7.99
$1N2474: length 4.3
  Top Layer w0.5: R42.1 44.81,16.64 U3.6
  Top Layer w1: R42.1 44.62,16.45 C28.2
$1N2475: length 3.3
  Top Layer w0.8: L4.1 46.35,18.29 U3.7
$1N2486: length 17.6
  Top Layer w0.5: R46.2 R45.2 40.52,25.96 44.48,25.96 44.81,25.63 U3.3
$1N2487: length 30
  Top Layer w0.5: U3.4 42.81,25.11 40.14,25.11 34.02,31.23 31.15,31.23 30.48,31.89 30.48,36.05 31.32,36.89 LED6.2 39.4,37.13 LED3.1
$1N2490: length 14.8
  Top Layer w0.5: U3.2 46.08,25.63 44.98,26.72 42.94,26.72 39.53,30.14 R43.2 39.49,32.43 R44.2
$1N2500: length 1.6
  Top Layer w0.5: 31.33,35.53 31.33,33.98 31.31,33.97
$1N2501: length 1.5
  Top Layer w0.5: 34.02,33.97 34.02,35.47 LED5.2
$1N2502: length 1.6
  Top Layer w0.5: LED4.1 36.77,35.43 R44.1
$1N2503: length 1.5
  Top Layer w0.5: LED3.2 39.53,35.4 39.53,33.97
$1N2504: length 1.9
  Top Layer w0.8: R41.1 49.7,25.99 C23.2
$1N2907: length 6.7
  Top Layer w0.4: 47.47,30.82 47.44,30.85 47.44,32.03 47.89,32.48 R47.2
$1N2911: length 6.7
  Top Layer w0.4: 46.47,30.82 46.47,32.07 45.96,32.58 41.21,32.58
$1N3566: length 6.7
  Top Layer w0.4: C8.2 59.58,24.96 60.33,24.2 U7.6
  Top Layer w1: L3.1 59.18,25.23 C8.2
$1N3570: length 1.8
  Top Layer w0.4: U7.7 59.45,23.55 C8.1
$1N3574: length 1.8
  Top Layer w0.4: R9.2 65.21,23.55 U7.2
$1N3650: length 1.9
  Top Layer w0.3: R10.2 53.67,5.65 LED9.2
$1N3729: length 6.2
  Top Layer w0.4: R49.1 61.12,20.49 C7.1 62.87,20.44 63.71,21.27 U7.1
$1N10525: length 18.7
  Top Layer w0.5: U3.5 43.54,19.87 34.35,29.06 R63.2
$1N10529: length 7.9
  Top Layer w0.4: C21.2 25.79,31.98 27.76,31.98
  Top Layer w0.5: R63.1 28.45,31.29 27.76,31.98
$2N2480: length 3.4
  Top Layer w0.5: R56.1 26.28,3.84
$3N487: length 3.4
  Top Layer w0.4: R60.2 R59.1 24.67,10.4 U11.5
$3N1031: length 15.1
  Top Layer w0.4: R58.1 16.35,8.92 16.98,9.55 20.66,9.55 22.9,11.8 24.4,11.8 U11.6
  Top Layer w0.5: C41.2 R58.1 CN7.2
$3N1312: length 1.8
  Top Layer w0.4: R62.2 28.42,12.65 LED13.2

## Copper pours and planes (outline as drawn; the poured copper is in the pictures)
GND on Top Layer: 0.2,36.05 0.22,36.31 0.27,36.66 0.36,37 0.49,37.32 0.65,37.63 0.85,37.91 1.08,38.17 1.34,38.41 1.63,38.61 1.94,38.77 2.26,38.9 2.6,38.99 2.94,39.04 3.2,39.05 64.37,39.05 64.63,39.04 64.98,38.99 65.32,38.9 65.64,38.77 65.95,38.61 66.23,38.41 66.49,38.17 66.73,37.91 66.93,37.63 67.09,37.32 67.22,37 67.31,36.66 67.36,36.31 67.37,36.05 67.37,3.39 67.36,3.13 67.31,2.79 67.22,2.45 67.09,2.13 66.93,1.82 66.73,1.53 66.49,1.27 66.23,1.04 65.95,0.84 65.64,0.68 65.32,0.55 64.98,0.46 64.63,0.41 64.37,0.39 3.2,0.39 2.94,0.41 2.6,0.46 2.26,0.55 1.94,0.68 1.63,0.84 1.34,1.04 1.08,1.27 0.85,1.53 0.65,1.82 0.49,2.13 0.36,2.45 0.27,2.79 0.22,3.13 0.2,3.39
GND on Bottom Layer: 0.13,35.8 0.14,36.06 0.19,36.41 0.28,36.74 0.41,37.07 0.58,37.38 0.78,37.66 1.01,37.92 1.27,38.15 1.56,38.35 1.86,38.52 2.19,38.65 2.52,38.74 2.87,38.79 3.13,38.8 64.3,38.8 64.56,38.79 64.9,38.74 65.24,38.65 65.57,38.52 65.87,38.35 66.16,38.15 66.42,37.92 66.65,37.66 66.85,37.38 67.02,37.07 67.15,36.74 67.24,36.41 67.29,36.06 67.3,35.8 67.3,3.14 67.29,2.88 67.24,2.54 67.15,2.2 67.02,1.87 66.85,1.57 66.65,1.28 66.42,1.02 66.16,0.79 65.87,0.59 65.57,0.42 65.24,0.29 64.9,0.2 64.56,0.15 64.3,0.14 3.13,0.14 2.87,0.15 2.52,0.2 2.19,0.29 1.86,0.42 1.56,0.59 1.27,0.79 1.01,1.02 0.78,1.28 0.58,1.57 0.41,1.87 0.28,2.2 0.19,2.54 0.14,2.88 0.13,3.14
VCC0 on Top Layer: 44.98,5.47 50.65,5.47 50.65,2.76 44.98,2.76
BATTERY_GND on Top Layer: 34.37,10.03 35,10.03 35,3.81 34.37,3.81
BATTERY_GND on Top Layer: 34.37,3.81 37.85,3.81 37.85,3.07 34.37,3.07
BATTERY_GND on Top Layer: 30.56,8.38 32.44,8.38 32.44,3.76 30.56,3.76
$1N2494 on Top Layer: 32.81,11.67 33.97,11.67 33.97,7.24 32.81,7.24

Small or netless copper shapes (teardrops, artwork), in the pictures only: 175 on Top Layer, 15 on Bottom Layer

## Text on the board
Bottom Silkscreen Layer: VCC | GND | SWCLK | SWDIO | 征龙凌沧战队 装甲板Rev1.2 | 东北大学秦皇岛分校
Top Silkscreen Layer: 100% | 75% | 50% | 25% | PWM+ | RST | 碰撞检测接口 | 充电LED设置开关 | 左红右蓝 | 3.3V供电 | 左USB右XT30 | - | +
